# EAGLE design opendeck_mini (EAGLE 7.4.0)
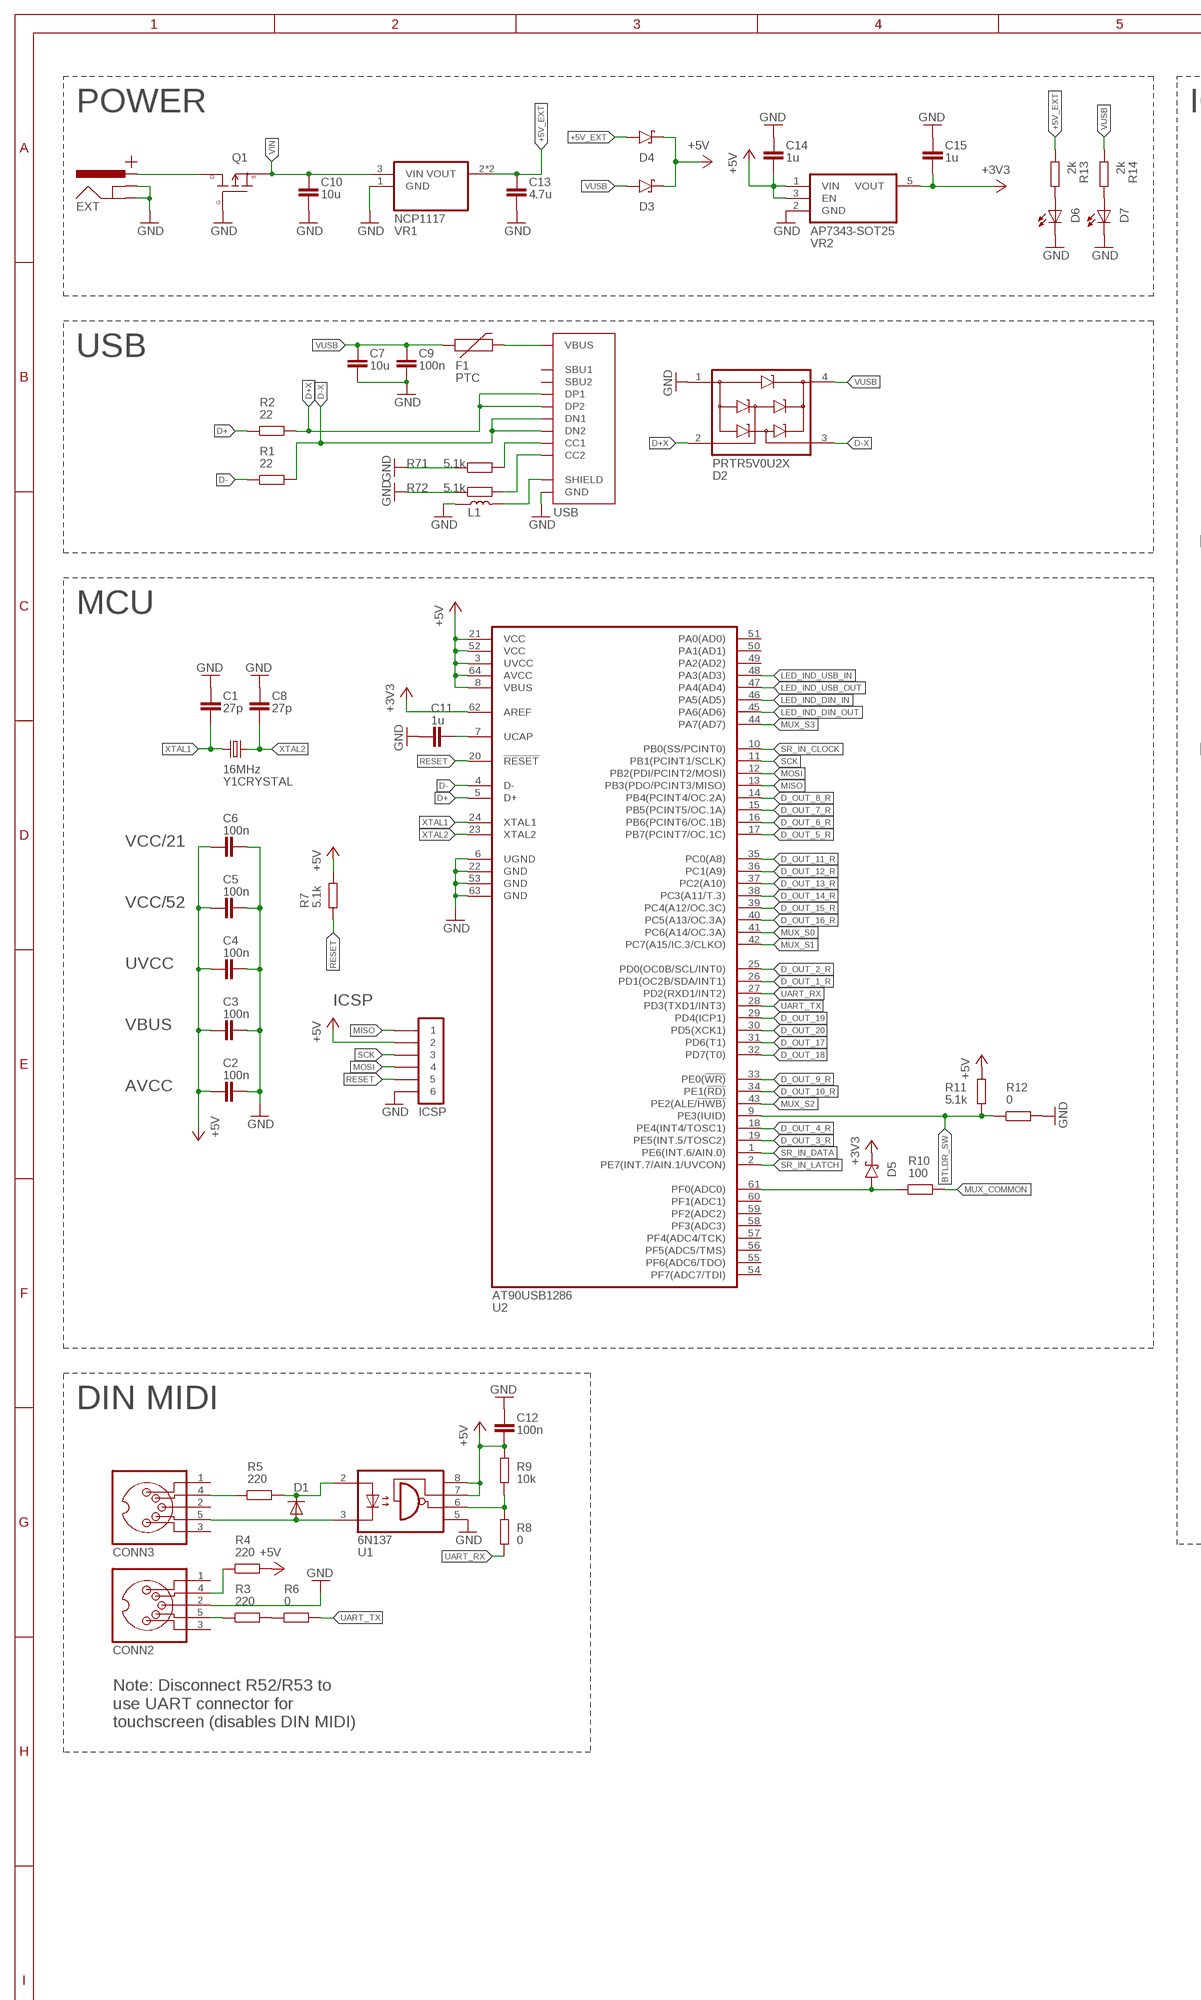
[diagram p0: schematic, sheet 1, part 1 of 2]
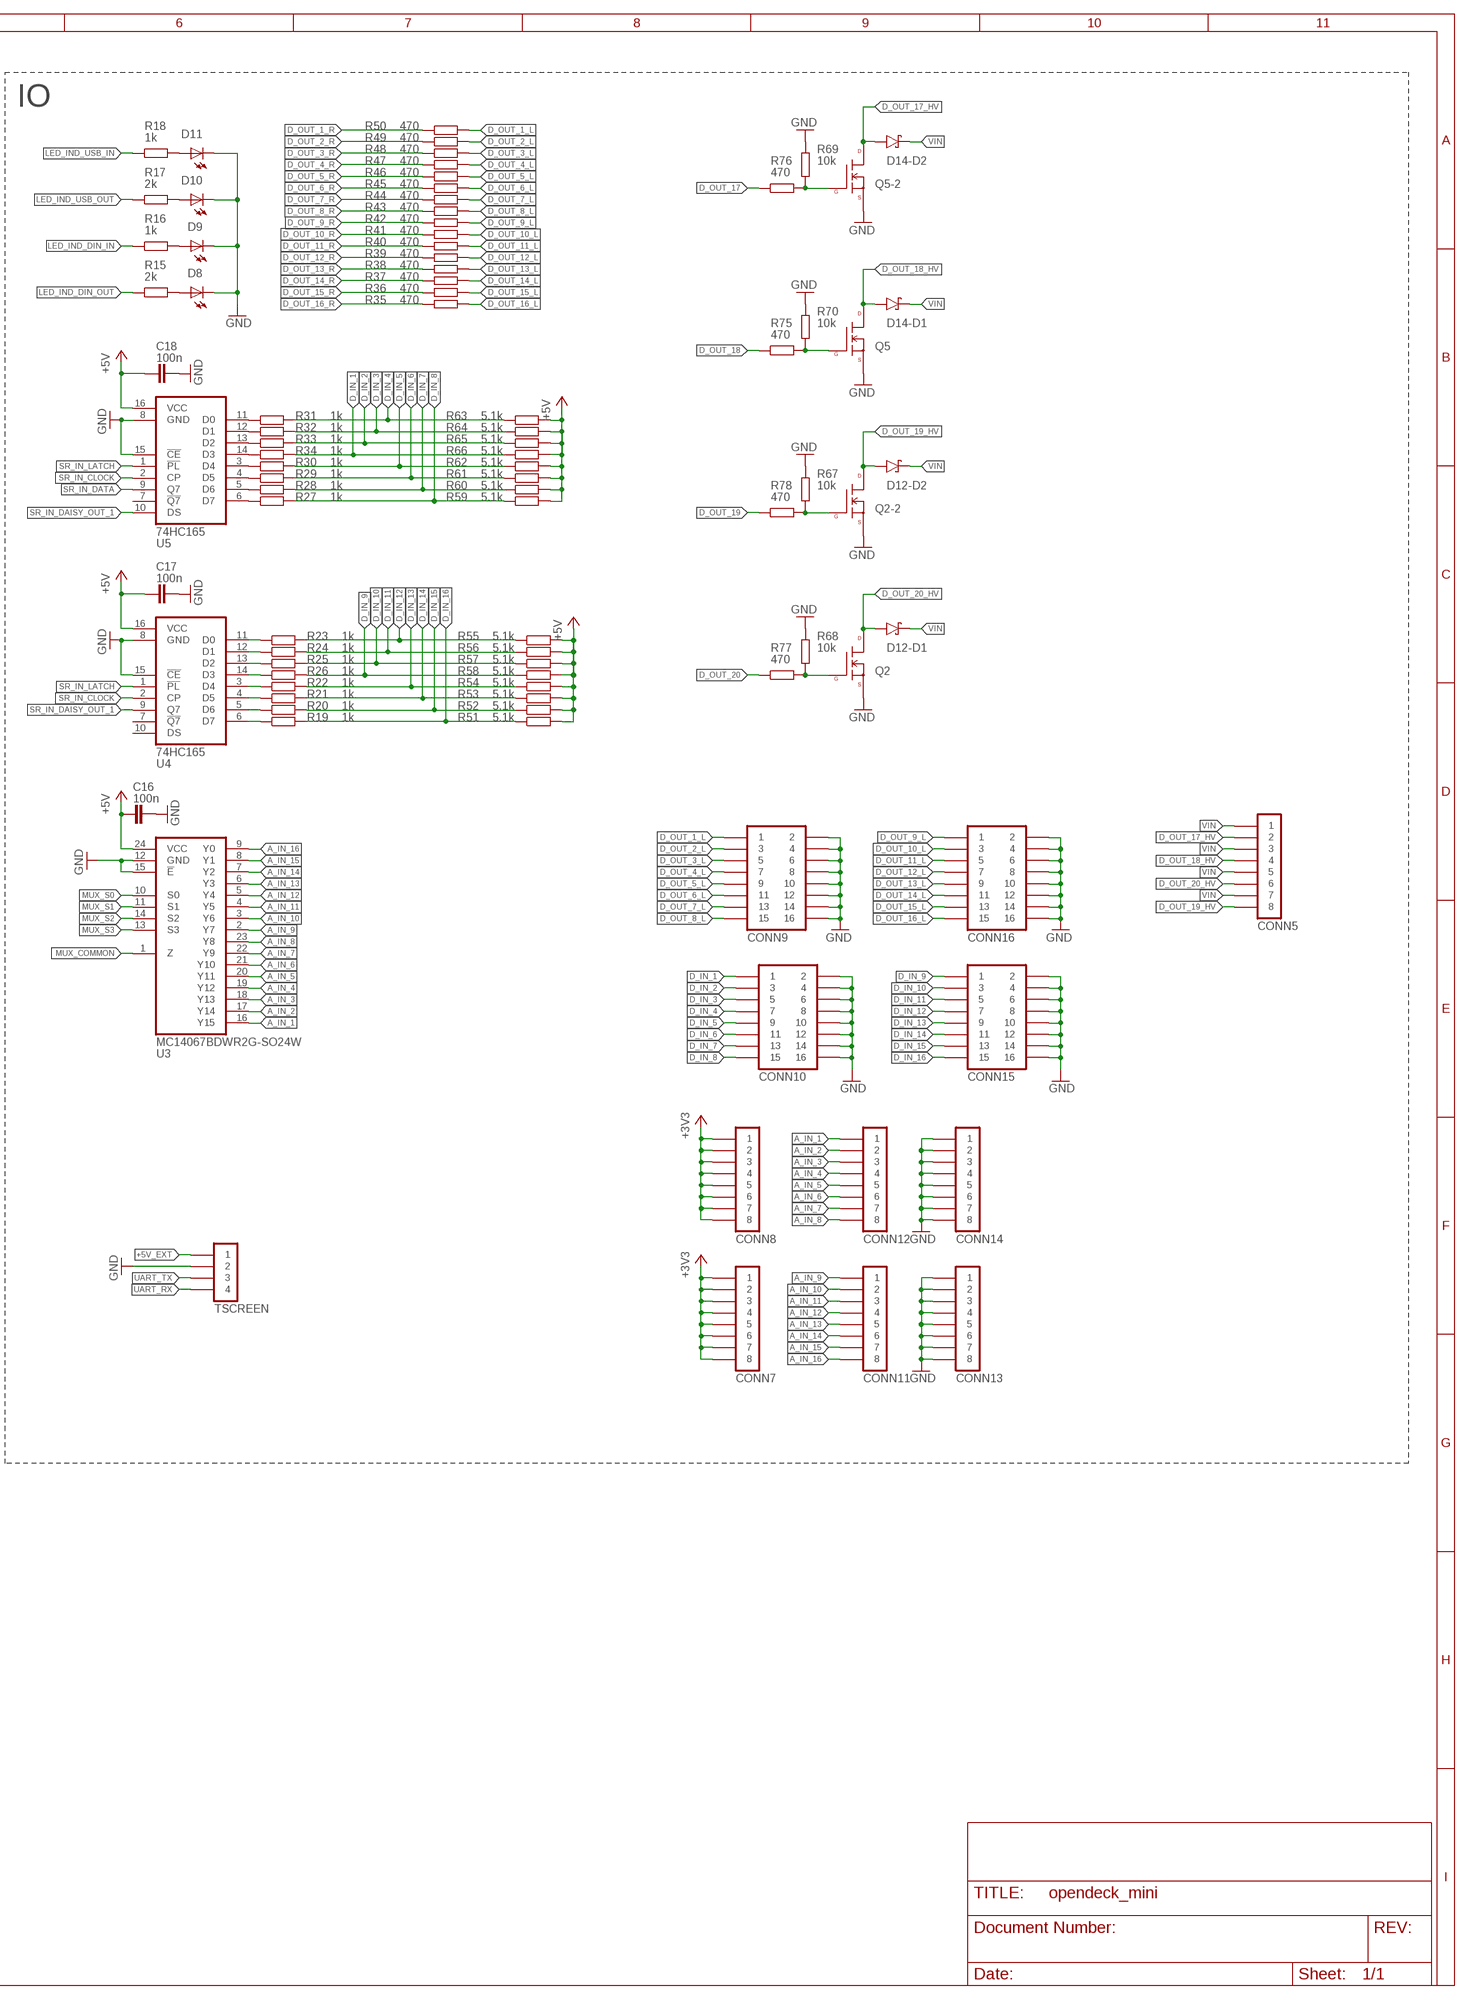
[diagram p1: schematic, sheet 1, part 2 of 2]

## Parts
C1  27p  CAPACITOR-0402  [C0402]
C2  100n  CAPACITOR-0402  [C0402]
C3  100n  CAPACITOR-0402  [C0402]
C4  100n  CAPACITOR-0402  [C0402]
C5  100n  CAPACITOR-0402  [C0402]
C6  100n  CAPACITOR-0402  [C0402]
C7  10u  CAPACITOR-0805  [C0805]
C8  27p  CAPACITOR-0402  [C0402]
C9  100n  CAPACITOR-0402  [C0402]
C10  10u  CAPACITOR-0805  [C0805]
C11  1u  CAPACITOR-0603  [C0603]
C12  100n  CAPACITOR-0402  [C0402]
C13  4.7u  CAPACITOR-0603  [C0603]
C14  1u  CAPACITOR-0603  [C0603]
C15  1u  CAPACITOR-0603  [C0603]
C16  100n  CAPACITOR-0402  [C0402]
C17  100n  CAPACITOR-0402  [C0402]
C18  100n  CAPACITOR-0402  [C0402]
CONN2  MIDI_CONN-STD  [DIN5]
CONN3  MIDI_CONN-STD  [DIN5]
CONN5  PINHD-1X08  [PHOENIX_CONTACT-1984675]
CONN7  PINHD-1X08-TH-2.54MM  [1X08-2.54]
CONN8  PINHD-1X08-TH-2.54MM  [1X08-2.54]
CONN9  PINHD-2X08-TH-2.54MM  [2X08-2.54]
CONN10  PINHD-2X08-TH-2.54MM  [2X08-2.54]
CONN11  PINHD-1X08-TH-2.54MM  [1X08-2.54]
CONN12  PINHD-1X08-TH-2.54MM  [1X08-2.54]
CONN13  PINHD-1X08-TH-2.54MM  [1X08-2.54]
CONN14  PINHD-1X08-TH-2.54MM  [1X08-2.54]
CONN15  PINHD-2X08-TH-2.54MM  [2X08-2.54]
CONN16  PINHD-2X08-TH-2.54MM  [2X08-2.54]
D1  1N4148  DIODE-SOD323  [SOD-323]
D2  PRTR5V0U2X  [SOT143]
D3  BAT46INFEON-SOD123  [SOD-123]
D4  BAT46INFEON-SOD123  [SOD-123]
D5  BAT46-SOT23  [SOT23]
D6  Green  LED-0805  [0805_LED]
D7  Blue  LED-0805  [0805_LED]
D8  Red  LED-0805  [0805_LED]
D9  Yellow  LED-0805  [0805_LED]
D10  Red  LED-0805  [0805_LED]
D11  Yellow  LED-0805  [0805_LED]
D12  BAS7007E6327HTSA1  [SOT143]
D14  BAS7007E6327HTSA1  [SOT143]
EXT  BARREL_JACK  [BARREL_JACK]
F1  PTC  [L1812]
ICSP  PINHD-2X03-TH-2.54MM-V  [2X03-2.54-V]
L1  FERRITE_BEAD-BLM21PG221SN1D  [L0805]
Q1  BSS314PEH6327XTSA1  [SOT23]
Q2  NTGD3148N  [TSOP-6]
Q5  NTGD3148N  [TSOP-6]
R1  22  RESISTOR-0402  [R0402]
R2  22  RESISTOR-0402  [R0402]
R3  220  RESISTOR-0402  [R0402]
R4  220  RESISTOR-0402  [R0402]
R5  220  RESISTOR-0402  [R0402]
R6  0  RESISTOR-TH-2.54  [1X02-2.54-V]
R7  5.1k  RESISTOR-0402  [R0402]
R8  0  RESISTOR-TH-2.54  [1X02-2.54-V]
R9  10k  RESISTOR-0402  [R0402]
R10  100  RESISTOR-0402  [R0402]
R11  5.1k  RESISTOR-0402  [R0402]
R12  0  RESISTOR-TH-2.54  [1X02-2.54-V]
R13  2k  RESISTOR-0402  [R0402]
R14  2k  RESISTOR-0402  [R0402]
R15  2k  RESISTOR-0402  [R0402]
R16  1k  RESISTOR-0402  [R0402]
R17  2k  RESISTOR-0402  [R0402]
R18  1k  RESISTOR-0402  [R0402]
R19  1k  RESISTOR-0402  [R0402]
R20  1k  RESISTOR-0402  [R0402]
R21  1k  RESISTOR-0402  [R0402]
R22  1k  RESISTOR-0402  [R0402]
R23  1k  RESISTOR-0402  [R0402]
R24  1k  RESISTOR-0402  [R0402]
R25  1k  RESISTOR-0402  [R0402]
R26  1k  RESISTOR-0402  [R0402]
R27  1k  RESISTOR-0402  [R0402]
R28  1k  RESISTOR-0402  [R0402]
R29  1k  RESISTOR-0402  [R0402]
R30  1k  RESISTOR-0402  [R0402]
R31  1k  RESISTOR-0402  [R0402]
R32  1k  RESISTOR-0402  [R0402]
R33  1k  RESISTOR-0402  [R0402]
R34  1k  RESISTOR-0402  [R0402]
R35  470  RESISTOR-0402  [R0402]
R36  470  RESISTOR-0402  [R0402]
R37  470  RESISTOR-0402  [R0402]
R38  470  RESISTOR-0402  [R0402]
R39  470  RESISTOR-0402  [R0402]
R40  470  RESISTOR-0402  [R0402]
R41  470  RESISTOR-0402  [R0402]
R42  470  RESISTOR-0402  [R0402]
R43  470  RESISTOR-0402  [R0402]
R44  470  RESISTOR-0402  [R0402]
R45  470  RESISTOR-0402  [R0402]
R46  470  RESISTOR-0402  [R0402]
R47  470  RESISTOR-0402  [R0402]
R48  470  RESISTOR-0402  [R0402]
R49  470  RESISTOR-0402  [R0402]
R50  470  RESISTOR-0402  [R0402]
R51  5.1k  RESISTOR-0402  [R0402]
R52  5.1k  RESISTOR-0402  [R0402]
R53  5.1k  RESISTOR-0402  [R0402]
R54  5.1k  RESISTOR-0402  [R0402]
R55  5.1k  RESISTOR-0402  [R0402]
R56  5.1k  RESISTOR-0402  [R0402]
R57  5.1k  RESISTOR-0402  [R0402]
R58  5.1k  RESISTOR-0402  [R0402]
R59  5.1k  RESISTOR-0402  [R0402]
R60  5.1k  RESISTOR-0402  [R0402]
R61  5.1k  RESISTOR-0402  [R0402]
R62  5.1k  RESISTOR-0402  [R0402]
R63  5.1k  RESISTOR-0402  [R0402]
R64  5.1k  RESISTOR-0402  [R0402]
R65  5.1k  RESISTOR-0402  [R0402]
R66  5.1k  RESISTOR-0402  [R0402]
R67  10k  RESISTOR-0402  [R0402]
R68  10k  RESISTOR-0402  [R0402]
R69  10k  RESISTOR-0402  [R0402]
R70  10k  RESISTOR-0402  [R0402]
R71  5.1k  RESISTOR-0402  [R0402]
R72  5.1k  RESISTOR-0402  [R0402]
R75  470  RESISTOR-0402  [R0402]
R76  470  RESISTOR-0402  [R0402]
R77  470  RESISTOR-0402  [R0402]
R78  470  RESISTOR-0402  [R0402]
TSCREEN  PINHD-1X04-TH-2.54MM  [1X04-2.54]
U1  6N137  [DIL08]
U2  AT90USB1286  [TQFP-64-14X14]
U3  MC14067BDWR2G-SO24W  [SO24-W]
U4  74HC165  [SO16]
U5  74HC165  [SO16]
USB  USB-C  [GCT-USB4085-GF-A]
VR1  NCP1117  [SOT223]
VR2  AP7343-SOT25  [SOT25]
Y1  16MHz  CRYSTAL-4P-SMD-3.2X2.5  [CRYSTAL-SMD-3.2X2.5]

## Nets
+3V3: C15.2 CONN7.1 CONN7.2 CONN7.3 CONN7.4 CONN7.5 CONN7.6 CONN7.7 CONN7.8 CONN8.1 CONN8.2 CONN8.3 CONN8.4 CONN8.5 CONN8.6 CONN8.7 CONN8.8 D5.3(C) U2.62(AREF) VR2.5(VOUT)
+5V: C2.1 C3.1 C4.1 C5.1 C6.1 C12.2 C14.2 C16.1 C17.1 C18.1 D3.C D4.C ICSP.2 R4.2 R7.2 R9.2 R11.2 R51.2 R52.2 R53.2 R54.2 R55.2 R56.2 R57.2 R58.2 R59.2 R60.2 R61.2 R62.2 R63.2 R64.2 R65.2 R66.2 U1.7(VE) U1.8(VCC) U2.3(UVCC) U2.8(VBUS) U2.21(VCC) U2.52(VCC) U2.64(AVCC) U3.24(VCC) U4.16(VCC) U5.16(VCC) VR2.1(VIN) VR2.3(EN)
+5V_EXT: C13.1 D4.A R13.1 TSCREEN.1 VR1.2(VOUT) VR1.4(VOUT)
A_IN_1: CONN12.1 U3.16(Y15)
A_IN_2: CONN12.2 U3.17(Y14)
A_IN_3: CONN12.3 U3.18(Y13)
A_IN_4: CONN12.4 U3.19(Y12)
A_IN_5: CONN12.5 U3.20(Y11)
A_IN_6: CONN12.6 U3.21(Y10)
A_IN_7: CONN12.7 U3.22(Y9)
A_IN_8: CONN12.8 U3.23(Y8)
A_IN_9: CONN11.1 U3.2(Y7)
A_IN_10: CONN11.2 U3.3(Y6)
A_IN_11: CONN11.3 U3.4(Y5)
A_IN_12: CONN11.4 U3.5(Y4)
A_IN_13: CONN11.5 U3.6(Y3)
A_IN_14: CONN11.6 U3.7(Y2)
A_IN_15: CONN11.7 U3.8(Y1)
A_IN_16: CONN11.8 U3.9(Y0)
BTLDR_SW: R11.1 R12.1 U2.9(PE3(IUID))
D+: R2.1 U2.5(D+)
D+X: D2.2(I/O1) R2.2 USB.A6(DP1) USB.B6(DP2)
D-: R1.1 U2.4(D-)
D-X: D2.3(I/O2) R1.2 USB.A7(DN1) USB.B7(DN2)
D_IN_1: CONN10.1 R34.2 R66.1
D_IN_2: CONN10.3 R33.2 R65.1
D_IN_3: CONN10.5 R32.2 R64.1
D_IN_4: CONN10.7 R31.2 R63.1
D_IN_5: CONN10.9 R30.2 R62.1
D_IN_6: CONN10.11 R29.2 R61.1
D_IN_7: CONN10.13 R28.2 R60.1
D_IN_8: CONN10.15 R27.2 R59.1
D_IN_9: CONN15.1 R26.2 R58.1
D_IN_10: CONN15.3 R25.2 R57.1
D_IN_11: CONN15.5 R24.2 R56.1
D_IN_12: CONN15.7 R23.2 R55.1
D_IN_13: CONN15.9 R22.2 R54.1
D_IN_14: CONN15.11 R21.2 R53.1
D_IN_15: CONN15.13 R20.2 R52.1
D_IN_16: CONN15.15 R19.2 R51.1
D_OUT_1_L: CONN9.1 R50.2
D_OUT_1_R: R50.1 U2.26(PD1(OC2B/SDA/INT1))
D_OUT_2_L: CONN9.3 R49.2
D_OUT_2_R: R49.1 U2.25(PD0(OC0B/SCL/INT0))
D_OUT_3_L: CONN9.5 R48.2
D_OUT_3_R: R48.1 U2.19(PE5(INT.5/TOSC2))
D_OUT_4_L: CONN9.7 R47.2
D_OUT_4_R: R47.1 U2.18(PE4(INT4/TOSC1))
D_OUT_5_L: CONN9.9 R46.2
D_OUT_5_R: R46.1 U2.17(PB7(PCINT7/OC.1C))
D_OUT_6_L: CONN9.11 R45.2
D_OUT_6_R: R45.1 U2.16(PB6(PCINT6/OC.1B))
D_OUT_7_L: CONN9.13 R44.2
D_OUT_7_R: R44.1 U2.15(PB5(PCINT5/OC.1A))
D_OUT_8_L: CONN9.15 R43.2
D_OUT_8_R: R43.1 U2.14(PB4(PCINT4/OC.2A))
D_OUT_9_L: CONN16.1 R42.1
D_OUT_9_R: R42.2 U2.33(PE0(!WR))
D_OUT_10_L: CONN16.3 R41.1
D_OUT_10_R: R41.2 U2.34(PE1(!RD))
D_OUT_11_L: CONN16.5 R40.1
D_OUT_11_R: R40.2 U2.35(PC0(A8))
D_OUT_12_L: CONN16.7 R39.1
D_OUT_12_R: R39.2 U2.36(PC1(A9))
D_OUT_13_L: CONN16.9 R38.1
D_OUT_13_R: R38.2 U2.37(PC2(A10))
D_OUT_14_L: CONN16.11 R37.1
D_OUT_14_R: R37.2 U2.38(PC3(A11/T.3))
D_OUT_15_L: CONN16.13 R36.1
D_OUT_15_R: R36.2 U2.39(PC4(A12/OC.3C))
D_OUT_16_L: CONN16.15 R35.1
D_OUT_16_R: R35.2 U2.40(PC5(A13/OC.3A))
D_OUT_17: R76.1 U2.31(PD6(T1))
D_OUT_17_HV: CONN5.2 D14.3(-D2:A) Q5.4(D)
D_OUT_18: R75.1 U2.32(PD7(T0))
D_OUT_18_HV: CONN5.4 D14.4(-D1:A) Q5.6(D)
D_OUT_19: R78.1 U2.29(PD4(ICP1))
D_OUT_19_HV: CONN5.8 D12.3(-D2:A) Q2.4(D)
D_OUT_20: R77.1 U2.30(PD5(XCK1))
D_OUT_20_HV: CONN5.6 D12.4(-D1:A) Q2.6(D)
GND: C1.1 C2.2 C3.2 C4.2 C5.2 C6.2 C7.2 C8.1 C9.2 C10.2 C11.1 C12.1 C13.2 C14.1 C15.1 C16.2 C17.2 C18.2 CONN2.2 CONN9.2 CONN9.4 CONN9.6 CONN9.8 CONN9.10 CONN9.12 CONN9.14 CONN9.16 CONN10.2 CONN10.4 CONN10.6 CONN10.8 CONN10.10 CONN10.12 CONN10.14 CONN10.16 CONN13.1 CONN13.2 CONN13.3 CONN13.4 CONN13.5 CONN13.6 CONN13.7 CONN13.8 CONN14.1 CONN14.2 CONN14.3 CONN14.4 CONN14.5 CONN14.6 CONN14.7 CONN14.8 CONN15.2 CONN15.4 CONN15.6 CONN15.8 CONN15.10 CONN15.12 CONN15.14 CONN15.16 CONN16.2 CONN16.4 CONN16.6 CONN16.8 CONN16.10 CONN16.12 CONN16.14 CONN16.16 D2.1(GND) D6.C D7.C D8.C D9.C D10.C D11.C EXT.GND@1(GND) EXT.GND@2(GNDBREAK) ICSP.6 L1.1 Q1.1(G) Q2.2(S) Q2.5(S) Q5.2(S) Q5.5(S) R12.2 R67.2 R68.2 R69.2 R70.2 R71.1 R72.1 TSCREEN.2 U1.5(GND) U2.6(UGND) U2.22(GND) U2.53(GND) U2.63(GND) U3.12(GND) U3.15(!E) U4.8(GND) U4.15(!CE) U5.8(GND) U5.15(!CE) USB.A1(GND) USB.A12(GND) USB.B1(GND) USB.B12(GND) VR1.1(GND) VR2.2(GND)
LED_IND_DIN_IN: R16.1 U2.46(PA5(AD5))
LED_IND_DIN_OUT: R15.1 U2.45(PA6(AD6))
LED_IND_USB_IN: R18.1 U2.48(PA3(AD3))
LED_IND_USB_OUT: R17.1 U2.47(PA4(AD4))
MISO: ICSP.1 U2.13(PB3(PDO/PCINT3/MISO))
MOSI: ICSP.4 U2.12(PB2(PDI/PCINT2/MOSI))
MUX_COMMON: R10.2 U3.1(Z)
MUX_S0: U2.41(PC6(A14/OC.3A)) U3.10(S0)
MUX_S1: U2.42(PC7(A15/IC.3/CLKO)) U3.11(S1)
MUX_S2: U2.43(PE2(ALE/!HWB)) U3.14(S2)
MUX_S3: U2.44(PA7(AD7)) U3.13(S3)
N$1: CONN3.4 R5.1
N$2: F1.2 USB.A4(VBUS) USB.A9(VBUS) USB.B4(VBUS) USB.B9(VBUS)
N$3: D1.C R5.2 U1.2(A)
N$4: CONN3.5 D1.A U1.3(C)
N$5: CONN2.4 R4.1
N$6: CONN2.5 R3.1
N$7: R3.2 R6.1
N$8: R34.1 U5.14(D3)
N$9: R33.1 U5.13(D2)
N$10: R32.1 U5.12(D1)
N$11: D11.A R18.2
N$12: D10.A R17.2
N$13: D9.A R16.2
N$14: D8.A R15.2
N$15: R31.1 U5.11(D0)
N$16: R30.1 U5.3(D4)
N$17: R29.1 U5.4(D5)
N$18: R28.1 U5.5(D6)
N$19: R27.1 U5.6(D7)
N$20: D5.1(A) R10.1 U2.61(PF0(ADC0))
N$21: D6.A R13.2
N$22: D7.A R14.2
N$23: R8.2 R9.1 U1.6(VO)
N$24: Q5.1(G) R70.1 R75.2
N$25: Q5.3(G) R69.1 R76.2
N$26: Q2.1(G) R68.1 R77.2
N$27: EXT.PWR1(PWR) Q1.2(S)
N$28: R71.2 USB.A5(CC1)
N$29: Q2.3(G) R67.1 R78.2
N$30: L1.2 USB.P1(SHIELD) USB.P2(SHIELD) USB.P3(SHIELD) USB.P4(SHIELD)
N$31: R72.2 USB.B5(CC2)
N$40: R26.1 U4.14(D3)
N$41: R25.1 U4.13(D2)
N$42: R24.1 U4.12(D1)
N$43: R23.1 U4.11(D0)
N$44: R22.1 U4.3(D4)
N$45: R21.1 U4.4(D5)
N$46: R20.1 U4.5(D6)
N$47: R19.1 U4.6(D7)
RESET: ICSP.5 R7.1 U2.20(!RESET)
SCK: ICSP.3 U2.11(PB1(PCINT1/SCLK))
SR_IN_CLOCK: U2.10(PB0(SS/PCINT0)) U4.2(CP) U5.2(CP)
SR_IN_DAISY_OUT_1: U4.9(Q7) U5.10(DS)
SR_IN_DATA: U2.1(PE6(INT.6/AIN.0)) U5.9(Q7)
SR_IN_LATCH: U2.2(PE7(INT.7/AIN.1/UVCON)) U4.1(!PL) U5.1(!PL)
UART_RX: R8.1 TSCREEN.4 U2.27(PD2(RXD1/INT2))
UART_TX: R6.2 TSCREEN.3 U2.28(PD3(TXD1/INT3))
UCAP: C11.2 U2.7(UCAP)
VIN: C10.1 CONN5.1 CONN5.3 CONN5.5 CONN5.7 D12.1(-D1:C) D12.2(-D2:C) D14.1(-D1:C) D14.2(-D2:C) Q1.3(D) VR1.3(VIN)
VUSB: C7.1 C9.1 D2.4(VCC) D3.A F1.1 R14.1
XTAL1: C1.2 U2.24(XTAL1) Y1.1
XTAL2: C8.2 U2.23(XTAL2) Y1.3
Unconnected: CONN2.1 CONN2.3 CONN3.1 CONN3.2 CONN3.3 U2.49(PA2(AD2)) U2.50(PA1(AD1)) U2.51(PA0(AD0)) U2.54(PF7(ADC7/TDI)) U2.55(PF6(ADC6/TDO)) U2.56(PF5(ADC5/TMS)) U2.57(PF4(ADC4/TCK)) U2.58(PF3(ADC3)) U2.59(PF2(ADC2)) U2.60(PF1(ADC1)) U4.7(!Q7) U4.10(DS) U5.7(!Q7) USB.A8(SBU1) USB.B8(SBU2) Y1.2(GND1:VEE) Y1.4(GND2:VEE)

## Notes on the sheet
- POWER | IO
- USB
- MCU
- VCC/21
- VCC/52
- UVCC
- ICSP
- VBUS
- AVCC
- DIN MIDI
- Note: Disconnect R52/R53 to
  use UART connector for
  touchscreen (disables DIN MIDI)

## Library data of the parts
C1-C18 = igor_lbr:CAPACITOR: Capacitor
CONN2 CONN3 = igor_lbr:MIDI_CONN: DIN MIDI connector; MANUFACTURER: Switchcraft; MPN: 57PC5F
CONN5 = igor_lbr:PINHD-1X08; MANUFACTURER: Phoenix Contact; MPN: 1984675
CONN7 CONN8 CONN11-CONN14 = igor_lbr:PINHD-1X08
CONN9 CONN10 CONN15 CONN16 = igor_lbr:PINHD-2X08
D1 = igor_lbr:DIODE: Diode; MANUFACTURER: Comchip Technology; MPN: 1N4148WS-HF
D2 = igor_lbr:PRTR5V0U2X: Ultra low capacitance double rail-to-rail ESD protection diode; MANUFACTURER: Nexperia; MPN: PRTR5V0U2X
D3 D4 = igor_lbr:BAT46: Schottky Diode; MANUFACTURER: Infineon Technologies; MPN: BAT60AE6327HTSA1
D5 = igor_lbr:BAT46: Schottky Diode; MANUFACTURER: Micro Commercial Components (MCC); MPN: MMBD301-TP
D6-D11 = igor_lbr:LED: LED
D12 D14 = igor_lbr:BAS7007E6327HTSA1: Dual Schottky Diode; MANUFACTUER: Infineon; MPN: BAS7007E6327HTSA1
EXT = igor_lbr:BARREL_JACK: 5.5mm jack, with a 2.1mm center pole diameter; MANUFACTURER: Gravitech; MPN: CON-SOCJ-2155
F1 = igor_lbr:PTC: Fuse; MANUFACTURER: Bourns; MPN: MF-MSMF050-2
ICSP = igor_lbr:PINHD-2X03
L1 = igor_lbr:FERRITE_BEAD: Ferrite Bead; MANUFACTURER: Murata; MPN: BLM21PG221SN1D
Q1 = igor_lbr:BSS314PEH6327XTSA1: P-Channel 20 V (D-S) MOSFET; MANUFACTURER: Infineon Technologies; MPN: BSS314PEH6327XTSA1
Q2 Q5 = igor_lbr:NTGD3148N: Dual N-channel MOSFET; MANUFACTURER: ON Semiconductor; MPN: NTGD3148NT1G
R1-R72 R75-R78 = igor_lbr:RESISTOR: Resistor
TSCREEN = igor_lbr:PINHD-1X04
U1 = igor_lbr:6N137: High Speed Optocoupler; MANUFACTURER: Vishay; MPN: 6N137
U2 = igor_lbr:AT90USB1286: 8-bit microcontroller; MANUFACTURER: Microchip/Atmel; MPN: AT90USB1286-AU
U3 = igor_lbr:MC14067BDWR2G: 16-Channel Analog Multiplexer/Demultiplexer; MANUFACTURER: ON Semiconductor; MPN: MC14067BDWR2G
U4 U5 = igor_lbr:74*165: 8-bit parallel-in/serial out shift register; MANUFACTURER: Nexperia; MPN: 74HC165D
USB = igor_lbr:USB-C: USB-C 2.0; MANUFACTURER: GCT; MPN: USB4085-GF-A
VR1 = igor_lbr:NCP1117: Low-Dropout Positive Fixed and Adjustable Voltage Regulators; MANUFACTURER: ON Semiconductor; MPN: NCP1117ST50T3G
VR2 = igor_lbr:AP7343: 300mA 3.3V HIGH PSRR LOW NOISE LDO WITH ENABLE; MANUFACTURER: Diodes Incorporated; MPN: AP7343-33W5-7
Y1 = igor_lbr:CRYSTAL-4P: Crystal; MANUFACTURER: Epson; MPN: X1E0000210120 TSX-3225 16MHZ 16PF

## Board
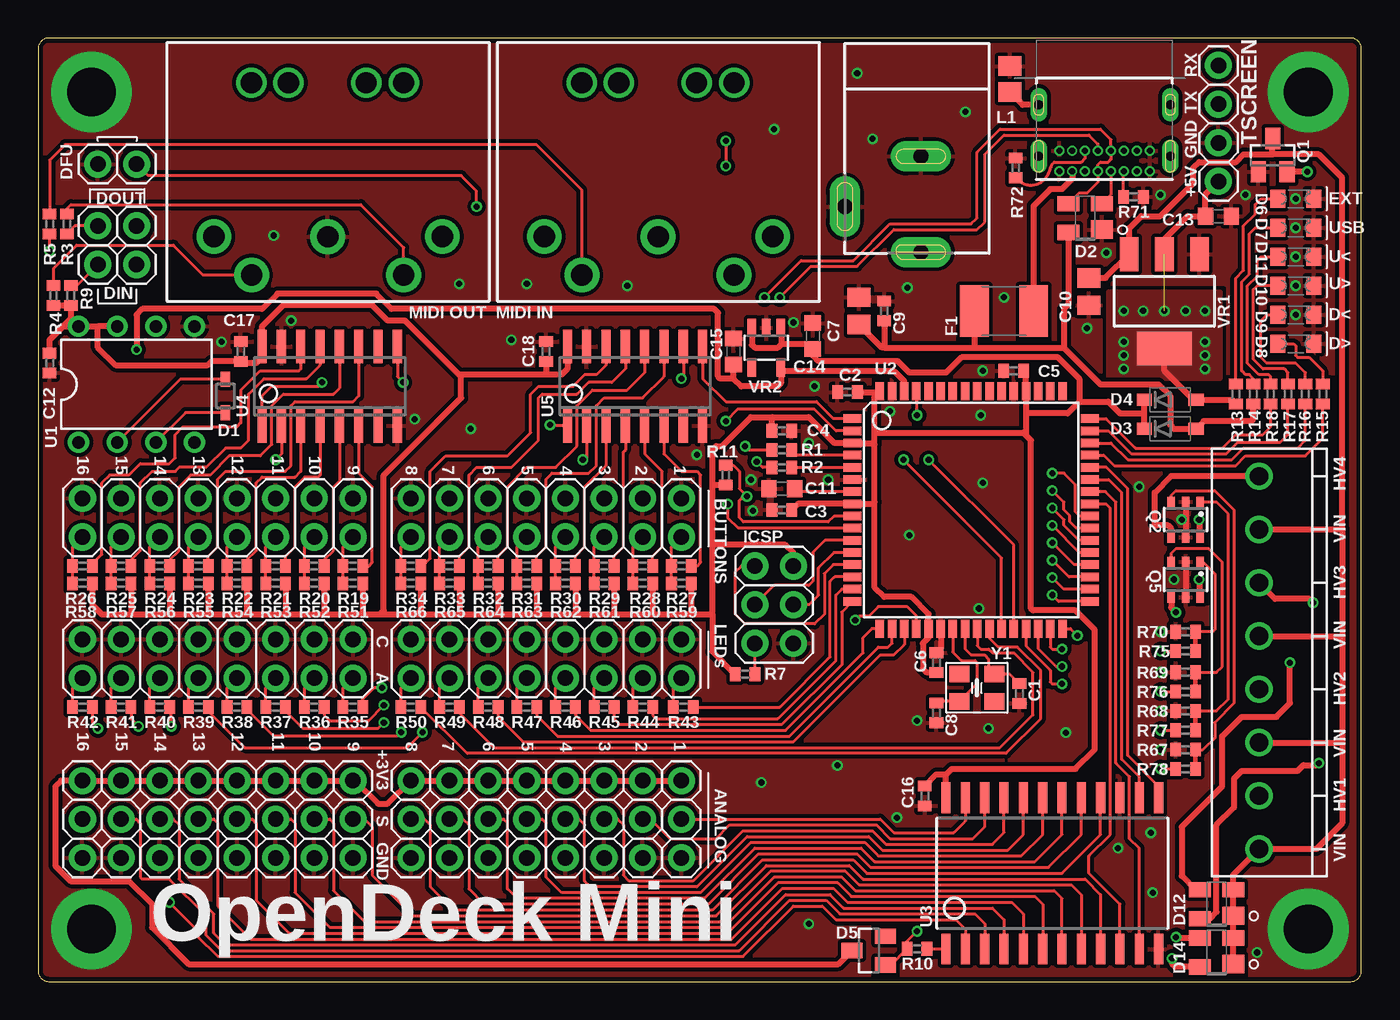
[diagram p2: board, top side]
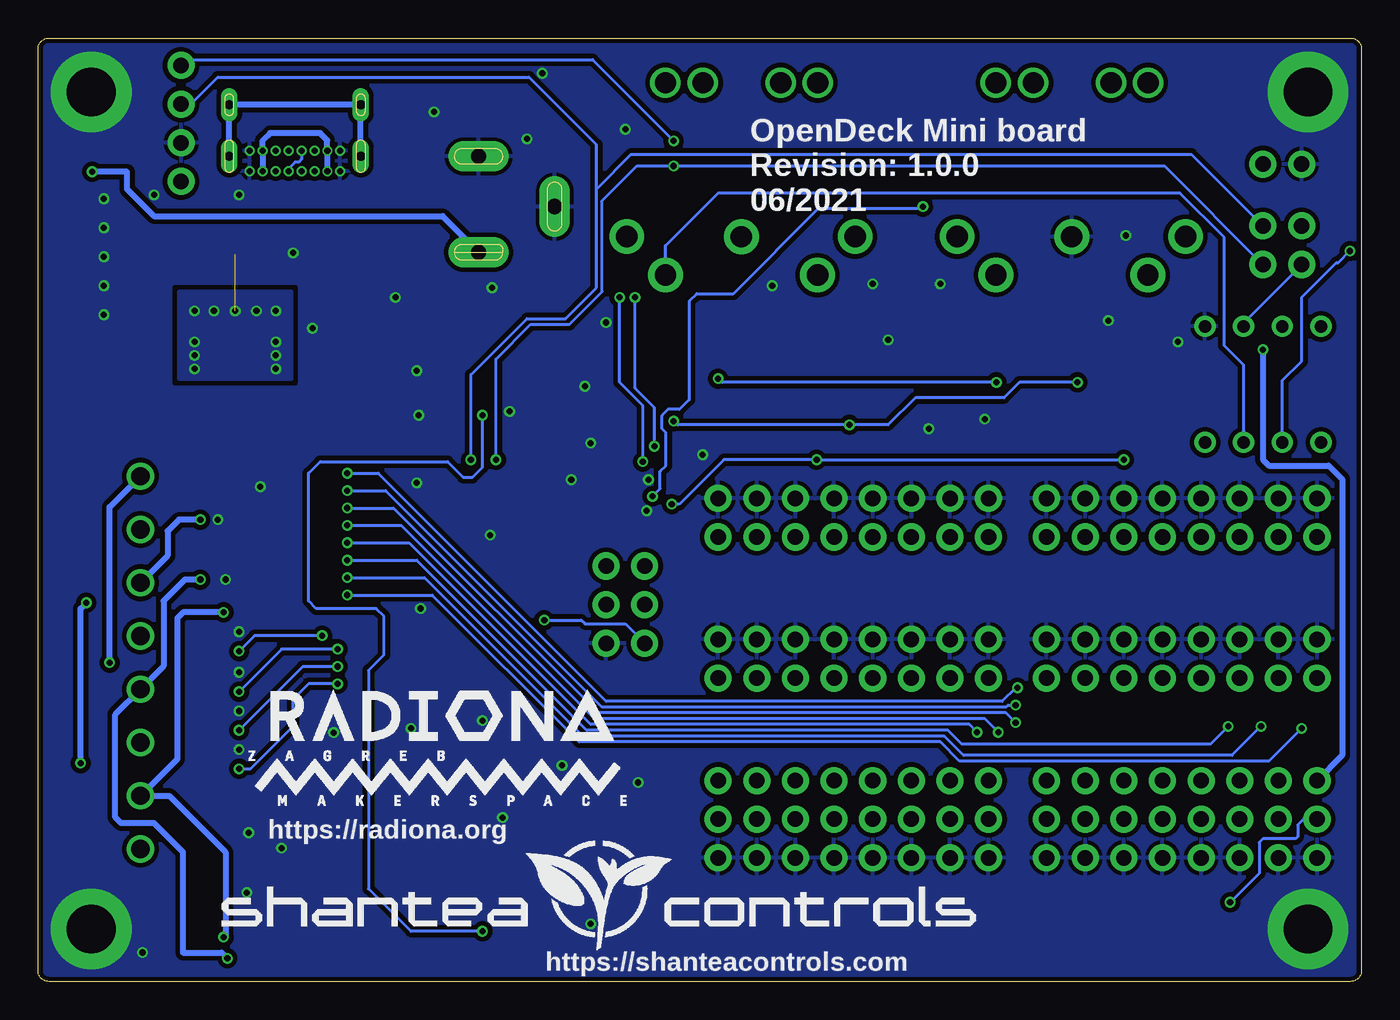
[diagram p3: board, bottom side, seen from below]

Size 87 x 62 mm. Coordinates in mm from the lower left corner, seen from the top.
Outline: 87,0.71 87,61.29 arc90 86.29,62 0.71,62 arc90 0,61.29 0,0.71 arc90 0.71,0 86.29,0 arc90 87,0.71
Copper layers (1*16): Top 0.035mm / dielectric 1.5mm / Bottom 0.035mm
Design rules "smiery *": minimum track width 8mil, minimum drill 12mil, track to track 7mil, track to pad 6mil, pad to pad 5mil, via to via 6mil, smd to smd 0mil, copper to edge 12mil, drill to drill 10mil, minimum pad ring 5mil, minimum via ring 5mil, stop-mask expansion 2mil, vias tented up to drill 25mil, thermal gap 10mil

### Footprints (pad centres in the part's own frame; a part is rotated, then mirrored left to right if it is on the bottom)
C0402 = smd 0.7 x 0.9: 1 -0.65,0; 2 0.65,0
C0805 = smd 1.27 x 1.524: 1 -0.9,0; 2 0.9,0
C0603 = smd 1 x 1.1: 1 -0.85,0; 2 0.85,0
DIN5 = drill 1.4 pad 2.286: 1 -7.483,-4.768; 2 -0.003,-4.778; 3 7.527,-4.768; 4 -5.013,-7.298; 5 4.987,-7.288 | drill 1.4 pad 2: 6 4.987,5.341; 7 -5.02,5.341; 8 -2.582,5.341; 9 2.523,5.341
PHOENIX_CONTACT-1984675 = drill 1.2 pad 1.8: 1 -12.25,0; 2 -8.75,0; 3 -5.25,0; 4 -1.75,0; 5 1.75,0; 6 5.25,0; 7 8.75,0; 8 12.25,0
1X08-2.54 = drill 1.016 pad 1.778: 1 -8.89,0; 2 -6.35,0; 3 -3.81,0; 4 -1.27,0; 5 1.27,0; 6 3.81,0; 7 6.35,0; 8 8.89,0
2X08-2.54 = drill 1.016 pad 1.778: 1 -8.89,-1.27; 2 -8.89,1.27; 3 -6.35,-1.27; 4 -6.35,1.27; 5 -3.81,-1.27; 6 -3.81,1.27; 7 -1.27,-1.27; 8 -1.27,1.27; 9 1.27,-1.27; 10 1.27,1.27; 11 3.81,-1.27; 12 3.81,1.27; 13 6.35,-1.27; 14 6.35,1.27; 15 8.89,-1.27; 16 8.89,1.27
SOD-323 = smd 1 x 0.6: A 1.1,0; C -1.1,0
SOT143 = smd 1.44 x 1.2: 1 -1.1,0.75 | smd 1.44 x 1: 2 -1.1,-0.95; 3 1.1,-0.95; 4 1.1,0.95
SOD-123 = smd 1 x 0.8: A -1.7,0; C 1.7,0
SOT23 = smd 1.4 x 1: 1 -1.1,0.95; 2 -1.1,-0.95; 3 1.1,0
0805_LED = smd 0.978 x 1.2: A -1.175,0; C 1.18,0
BARREL_JACK = drill 1 pad 2 long: GND@1 0,0.13; GND@2 5,3.43; PWR1 0,6.43
L1812 = smd 1.9 x 3.4: 1 -1.95,0; 2 1.95,0
2X03-2.54-V = drill 1.016 pad 1.778: 1 -2.54,-1.27; 2 -2.54,1.27; 3 0,-1.27; 4 0,1.27; 5 2.54,-1.27; 6 2.54,1.27
L0805 = smd 1.3 x 1.5: 1 -0.85,0; 2 0.85,0
TSOP-6 = smd 0.7 x 0.508: 1 -1.163,0.95; 2 -1.163,0; 3 -1.163,-0.95; 4 1.163,-0.95; 5 1.163,0; 6 1.163,0.95
R0402 = smd 0.7 x 0.9: 1 -0.65,0; 2 0.65,0
1X02-2.54-V = drill 1.016 pad 1.778: 1 -1.27,0; 2 1.27,0
1X04-2.54 = drill 1.016 pad 1.778: 1 -3.81,0; 2 -1.27,0; 3 1.27,0; 4 3.81,0
DIL08 = drill 0.813 pad 1.397: 1 -3.81,3.81; 2 -3.81,1.27; 3 -3.81,-1.27; 4 -3.81,-3.81; 5 3.81,-3.81; 6 3.81,-1.27; 7 3.81,1.27; 8 3.81,3.81
TQFP-64-14X14 = smd 1.194 x 0.559: 1 -7.8,6; 2 -7.8,5.2; 3 -7.8,4.4; 4 -7.8,3.6; 5 -7.8,2.8; 6 -7.8,2; 7 -7.8,1.2; 8 -7.8,0.4; 9 -7.8,-0.4; 10 -7.8,-1.2; 11 -7.8,-2; 12 -7.8,-2.8; 13 -7.8,-3.6; 14 -7.8,-4.4; 15 -7.8,-5.2; 16 -7.8,-6; 33 7.8,-6; 34 7.8,-5.2; 35 7.8,-4.4; 36 7.8,-3.6; 37 7.8,-2.8; 38 7.8,-2; 39 7.8,-1.2; 40 7.8,-0.4; 41 7.8,0.4; 42 7.8,1.2; 43 7.8,2; 44 7.8,2.8; 45 7.8,3.6; 46 7.8,4.4; 47 7.8,5.2; 48 7.8,6 | smd 0.559 x 1.194: 17 -6,-7.8; 18 -5.2,-7.8; 19 -4.4,-7.8; 20 -3.6,-7.8; 21 -2.8,-7.8; 22 -2,-7.8; 23 -1.2,-7.8; 24 -0.4,-7.8; 25 0.4,-7.8; 26 1.2,-7.8; 27 2,-7.8; 28 2.8,-7.8; 29 3.6,-7.8; 30 4.4,-7.8; 31 5.2,-7.8; 32 6,-7.8; 49 6,7.8; 50 5.2,7.8; 51 4.4,7.8; 52 3.6,7.8; 53 2.8,7.8; 54 2,7.8; 55 1.2,7.8; 56 0.4,7.8; 57 -0.4,7.8; 58 -1.2,7.8; 59 -2,7.8; 60 -2.8,7.8; 61 -3.6,7.8; 62 -4.4,7.8; 63 -5.2,7.8; 64 -6,7.8
SO24-W = smd 2.032 x 0.6: 1 -4.975,6.985; 2 -4.975,5.715; 3 -4.975,4.445; 4 -4.975,3.175; 5 -4.975,1.905; 6 -4.975,0.635; 7 -4.975,-0.635; 8 -4.975,-1.905; 9 -4.975,-3.175; 10 -4.975,-4.445; 11 -4.975,-5.715; 12 -4.975,-6.985; 13 4.975,-6.985; 14 4.975,-5.715; 15 4.975,-4.445; 16 4.975,-3.175; 17 4.975,-1.905; 18 4.975,-0.635; 19 4.975,0.635; 20 4.975,1.905; 21 4.975,3.175; 22 4.975,4.445; 23 4.975,5.715; 24 4.975,6.985
SO16 = smd 2.2 x 0.6: 1 -2.6,4.445; 2 -2.6,3.175; 3 -2.6,1.905; 4 -2.6,0.635; 5 -2.6,-0.635; 6 -2.6,-1.905; 7 -2.6,-3.175; 8 -2.6,-4.445; 9 2.6,-4.445; 10 2.6,-3.175; 11 2.6,-1.905; 12 2.6,-0.635; 13 2.6,0.635; 14 2.6,1.905; 15 2.6,3.175; 16 2.6,4.445
GCT-USB4085-GF-A = drill 0.4 pad 0.65: A1 -2.975,4.025; A4 -2.125,4.025; A5 -1.275,4.025; A6 -0.425,4.025; A7 0.425,4.025; A8 1.275,4.025; A9 2.125,4.025; A12 2.975,4.025; B1 2.975,2.675; B4 2.125,2.675; B5 1.275,2.675; B6 0.425,2.675; B7 -0.425,2.675; B8 -1.275,2.675; B9 -2.125,2.675; B12 -2.975,2.675 | drill 0.6 pad 1.1 long: P1 -4.325,3.045; P2 4.325,3.045; P3 4.325,-0.335; P4 -4.325,-0.335
SOT223 = smd 2.235 x 1.219: 1 -3.099,2.311; 2 -3.099,0; 3 -3.099,-2.311 | smd 2.2 x 3.6: 4 3.099,0
SOT25 = smd 0.55 x 1.2: 1 -0.95,-1.3; 2 0,-1.3; 3 0.95,-1.3; 4 0.95,1.3; 5 -0.95,1.3
CRYSTAL-SMD-3.2X2.5 = smd 1.3 x 1.1: 1 -1.15,-0.9; 2 1.15,-0.9; 3 1.15,0.9; 4 -1.15,0.9

### Placement (x,y rotation side)
C1  64.52,18.92 90 top
C2  53.21,38.73 180 top
C3  48.9,30.99 180 top
C4  48.9,36.2 0 top
C5  64.14,40.13 180 top
C6  59.05,20.95 90 top
C7  53.98,44.07 90 top
C8  59.05,17.65 90 top
C9  55.63,44.07 90 top
C10  69.09,45.34 270 top
C11  48.9,32.38 0 top
C12  0.76,40.64 90 top
C13  77.6,50.29 0 top
C14  50.93,42.42 270 top
C15  45.72,41.4 270 top
C16  58.29,12.19 270 top
C17  13.34,41.4 90 top
C18  33.4,41.4 90 top
CONN2  19.05,53.72 0 top
CONN3  40.77,53.72 0 top
CONN5  80.26,20.95 90 top
CONN7  11.81,13.21 0 top
CONN8  33.4,13.21 0 top
CONN9  33.4,21.21 0 top
CONN10  33.4,30.48 0 top
CONN11  11.81,10.67 0 top
CONN12  33.4,10.67 0 top
CONN13  11.81,8.13 0 top
CONN14  33.4,8.13 0 top
CONN15  11.81,30.48 0 top
CONN16  11.81,21.21 0 top
D1  12.32,38.48 270 top
D2  68.83,50.16 180 top
D3  74.42,36.32 180 top
D4  74.42,38.23 180 top
D5  54.61,2.03 180 top
D6  82.68,51.44 0 top
D7  82.68,49.53 0 top
D8  82.68,41.91 0 top
D9  82.68,43.81 0 top
D10  82.68,45.72 0 top
D11  82.68,47.62 0 top
D12  77.47,5.08 180 top
D14  77.47,1.91 180 top
EXT  58.04,54.36 180 top
F1  63.5,44.07 0 top
ICSP  48.39,24.77 270 top
L1  63.88,59.31 270 top
Q1  81.16,54.31 90 top
Q2  75.44,30.35 270 top
Q5  75.44,26.42 270 top
R1  48.9,34.92 180 top
R2  48.9,33.78 180 top
R3  1.91,49.78 270 top
R4  1.02,45.09 270 top
R5  0.76,49.78 270 top
R6  5.21,49.66 0 top
R7  46.48,20.19 180 top
R8  5.21,47.12 180 top
R9  2.16,45.09 270 top
R10  57.78,2.16 0 top
R11  45.21,33.27 270 top
R12  5.21,53.72 180 top
R13  78.74,38.61 90 top
R14  79.88,38.61 90 top
R15  84.45,38.61 90 top
R16  83.31,38.61 90 top
R17  82.17,38.61 90 top
R18  81.03,38.61 90 top
R19  20.7,27.3 180 top
R20  18.16,27.3 180 top
R21  15.62,27.3 180 top
R22  13.08,27.3 180 top
R23  10.54,27.3 180 top
R24  8,27.3 180 top
R25  5.46,27.3 180 top
R26  2.92,27.3 180 top
R27  42.29,27.3 180 top
R28  39.75,27.3 180 top
R29  37.21,27.3 180 top
R30  34.67,27.3 180 top
R31  32.13,27.3 180 top
R32  29.59,27.3 180 top
R33  27.05,27.3 180 top
R34  24.51,27.3 180 top
R35  20.7,18.03 0 top
R36  18.16,18.03 0 top
R37  15.62,18.03 0 top
R38  13.08,18.03 0 top
R39  10.54,18.03 0 top
R40  8,18.03 0 top
R41  5.46,18.03 0 top
R42  2.92,18.03 0 top
R43  42.42,18.03 180 top
R44  39.75,18.03 180 top
R45  37.21,18.03 180 top
R46  34.67,18.03 180 top
R47  32.13,18.03 180 top
R48  29.59,18.03 180 top
R49  27.05,18.03 180 top
R50  24.51,18.03 180 top
R51  20.7,26.16 0 top
R52  18.16,26.16 0 top
R53  15.62,26.16 0 top
R54  13.08,26.16 0 top
R55  10.54,26.16 0 top
R56  8,26.16 0 top
R57  5.46,26.16 0 top
R58  2.92,26.16 0 top
R59  42.29,26.16 0 top
R60  39.75,26.16 0 top
R61  37.21,26.16 0 top
R62  34.67,26.16 0 top
R63  32.13,26.16 0 top
R64  29.59,26.16 0 top
R65  27.05,26.16 0 top
R66  24.51,26.16 0 top
R67  75.44,15.24 180 top
R68  75.44,17.78 180 top
R69  75.44,20.32 180 top
R70  75.44,22.99 180 top
R71  72.01,51.56 180 top
R72  64.26,53.47 270 top
R75  75.44,21.72 0 top
R76  75.44,19.05 0 top
R77  75.44,16.51 0 top
R78  75.44,13.97 0 top
TSCREEN  77.6,56.39 90 top
U1  6.48,39.24 90 top
U2  61.34,30.99 0 top
U3  66.67,7.11 90 top
U4  19.18,39.12 90 top
U5  39.24,39.12 90 top
USB  70.1,57.28 180 top
VR1  74.04,44.7 270 top
VR2  47.88,41.66 180 top
Y1  61.72,19.3 180 top

### Tracks (layer width: path | path; a pad name or v marks a point on that pad's centre or on a via)
+3V3  (via drill 0.4 pad 0.7)
  Top 0.406: U2.62 56.94,39.45 56.29,40.1 49.08,40.1 VR2.5 48.83,39.3 48.64,39.12 46.23,39.12 45.72,39.62 | CONN8.8 CONN8.7 CONN8.6 CONN8.5 CONN8.4 CONN8.3 CONN8.2 CONN8.1 22.99,11.68 22.35,11.68 20.83,13.21 CONN7.8 CONN7.7 CONN7.6 CONN7.5 CONN7.4 CONN7.3 CONN7.2 CONN7.1 1.52,13.21 1.14,12.83 1.14,7.62 2.16,6.6 5.97,6.6 7.49,5.08 7.49,3.56 9.91,1.14 52.62,1.14 D5.3 | 45.72,39.62 C15.2 | 45.72,39.62 44.83,39.62 44.7,39.75 44.7,43.94 44.45,44.2 23.24,44.2 22.23,45.21 15.75,45.21 14.73,44.2 6.86,44.2 6.48,43.81 v6.48,41.53
  Bottom 0.406: v6.48,41.53 6.48,34.29 6.1,33.91 2.16,33.91 1.27,33.02 1.27,14.86 CONN7.1
+5V
  Top 0.406: 54.99,31.5 54.88,31.39 U2.8 49.95,31.39 C3.1 | 54.99,31.5 54.99,35.31 | 54.99,35.31 54.99,36.07 | 54.99,31.5 54.99,25.91 55.63,25.27 57.4,25.27 58.54,24.14 U2.21 58.54,22.6 58.17,22.23 58.17,20.57 58.44,20.3 C6.1 | 54.99,35.31 54.91,35.39 U2.3 52.37,35.39 50.67,37.08 48.26,37.08 | D3.C 72.72,37.34 | 72.72,37.34 D4.C | VR2.3 46.93,41.84 47.12,41.66 48.64,41.66 48.9,41.91 | 48.9,41.91 48.9,42.89 VR2.1 | 68.45,38.1 68.45,39.62 67.06,41.02 60.71,41.02 59.69,40.01 57.28,40.01 56.52,40.77 51.31,40.77 50.93,41.15 C14.2 50.59,41.91 48.9,41.91 | U3.24 59.69,13.59 | 59.69,13.59 60.07,13.97 68.2,13.97 69.47,15.24 69.47,23.11 68.2,24.38 65.41,24.38 65.28,24.51 65.28,35.56 64.94,35.9 | 6.22,24.13 4.19,24.13 3.57,24.75 R58.2 | 6.22,24.13 8.64,24.13 | 8.64,24.13 11.18,24.13 | 11.18,24.13 13.72,24.13 | 13.72,24.13 16.26,24.13 | 16.26,24.13 18.8,24.13 | 18.8,24.13 21.34,24.13 | 21.34,24.13 22.48,24.13 | 22.48,24.13 24.89,24.13 | 24.89,24.13 27.69,24.13 | 27.69,24.13 30.23,24.13 | 30.23,24.13 32.77,24.13 | 32.77,24.13 35.43,24.13 | 35.43,24.13 37.85,24.13 | 37.85,24.13 40.39,24.13 | 40.39,24.13 42.8,24.13 | 42.8,24.13 44.32,24.13 | 33.4,39.88 34.42,39.88 34.8,40.26 U5.16 | C18.1 33.4,39.88 | 33.4,39.88 27.69,39.88 | C5.1 64.94,39.98 U2.52 64.94,37.34 | 27.69,39.88 24.13,43.43 22.99,43.43 21.97,44.45 16.13,44.45 14.73,43.05 U4.16 14.73,41.02 14.35,40.64 13.45,40.64 C17.1 11.41,40.75 11.16,40.5 5.09,40.5 3.94,41.66 3.94,43.05 | C2.1 55.29,38.73 U2.64 54.99,38.44 54.99,36.07 | ICSP.2 49.66,28.19 49.15,28.7 44.45,28.7 44.32,28.57 | 59.69,13.59 59.04,13.59 C16.1 | U1.7 3.94,43.05 | 1.65,43.05 U1.8 3.94,43.05 | R4.2 R9.2 2.16,43.56 1.65,43.05
  Top 0.406: C12.2 0.76,42.16 1.65,43.05 | 44.32,24.13 44.32,21.7 R7.2 | 44.32,24.13 44.32,28.57 | 44.32,28.57 44.32,32.64 | 44.32,32.64 44.32,34.92 44.58,35.18 44.96,35.18 46.86,37.08 48.26,37.08 | 54.99,36.07 64.77,36.07 64.94,35.9 | 64.94,37.34 64.94,35.9 | 68.45,38.1 67.69,37.34 64.94,37.34 | 22.48,24.13 22.73,24.38 22.73,33.27 27.81,38.35 27.81,39.75 27.69,39.88 | 27.69,24.13 27.7,24.14 R65.2 | R11.2 44.34,32.62 44.32,32.64 | C4.1 48.24,37.07 48.26,37.08 | R66.2 25.16,24.4 24.89,24.13 | R64.2 30.24,24.14 30.23,24.13 | R63.2 32.78,24.14 32.77,24.13 | R62.2 35.32,24.24 35.43,24.13 | R61.2 37.86,24.14 37.85,24.13 | R60.2 40.4,24.14 40.39,24.13 | R59.2 42.94,24.27 42.8,24.13 | R57.2 6.11,24.24 6.22,24.13 | R56.2 8.65,24.14 8.64,24.13 | R55.2 11.19,24.14 11.18,24.13 | R54.2 13.73,24.14 13.72,24.13 | R53.2 16.27,24.14 16.26,24.13 | R52.2 18.81,24.14 18.8,24.13 | R51.2 21.35,24.14 21.34,24.13 | 68.45,38.1 70.36,38.1 71.12,37.34 72.72,37.34
+5V_EXT  (via drill 0.4 pad 0.7)  (1 unrouted)
  Top 0.406: TSCREEN.1 76.75,51.73 C13.1 75.56,50.29 74.04,48.77 VR1.2 | R13.1 78.47,38.23 D4.A 75.95,38.23 74.04,40.13 VR1.4
  other vias: 71.37,44.07 76.71,44.07 71.37,41.15 71.37,40.26 76.71,41.15 74.04,44.07 76.71,40.26 71.37,42.04 76.71,42.04 72.64,44.07 75.44,44.07
  pour Bottom (isolate 0.254, no thermals): 70.36,45.34 77.72,45.34 77.72,39.62 70.36,39.62
  pour Top (isolate 0.254, no thermals): 70.36,45.34 77.72,45.34 77.72,39.62 70.36,39.62
A_IN_1
  Top 0.203: CONN12.1 25.4,10.67 25.78,10.29 25.78,6.22 27.3,4.7 44.32,4.7 47.62,8 53.59,8 54.48,7.11 67.31,7.11 69.85,9.65 U3.16
A_IN_2
  Top 0.203: CONN12.2 27.94,10.67 28.32,10.29 28.32,6.1 29.34,5.08 44.07,5.08 47.37,8.38 53.85,8.38 54.74,7.49 66.42,7.49 68.58,9.65 U3.17
A_IN_3
  Top 0.203: CONN12.3 30.61,10.67 30.86,10.41 30.86,6.1 31.5,5.46 43.81,5.46 47.12,8.76 54.1,8.76 54.99,7.87 65.53,7.87 67.31,9.65 U3.18
A_IN_4
  Top 0.203: CONN12.4 33.15,10.67 33.4,10.41 33.4,6.86 34.42,5.84 43.56,5.84 46.86,9.14 54.36,9.14 55.24,8.26 64.64,8.26 66.04,9.65 U3.19
A_IN_5
  Top 0.203: CONN12.5 35.56,10.67 35.94,10.29 35.94,6.6 36.32,6.22 43.31,6.22 46.61,9.53 54.61,9.53 55.5,8.64 63.75,8.64 64.77,9.65 U3.20
A_IN_6
  Top 0.203: CONN12.6 38.1,10.67 38.48,10.29 38.48,6.99 38.86,6.6 43.05,6.6 46.35,9.91 54.86,9.91 55.75,9.02 62.74,9.02 63.5,9.78 U3.21
A_IN_7
  Top 0.203: CONN12.7 40.26,10.67 41.53,9.4 44.58,9.4 45.47,10.29 55.12,10.29 56.01,9.4 61.47,9.4 62.23,10.16 U3.22
A_IN_8
  Top 0.203: U3.23 60.96,10.54 60.2,9.78 56.26,9.78 55.37,10.67 CONN12.8
A_IN_9  (via drill 0.4 pad 0.7)
  Top 0.203: U3.2 60.96,3.43 60.33,4.06 52.45,4.06 51.56,4.95 49.66,4.95 46.35,1.65 11.81,1.65 10.54,2.92 10.54,3.3 v8.64,5.21
  Bottom 0.203: CONN11.1 3.81,10.67 4.19,10.29 4.19,9.53 4.32,9.4 6.48,9.4 6.73,9.14 6.73,7.11 v8.64,5.21
A_IN_10
  Top 0.203: CONN11.2 6.48,10.67 6.73,10.41 6.73,6.86 6.86,6.73 8.64,6.73 11.05,4.32 11.05,3.05 12.06,2.03 46.1,2.03 49.4,5.33 51.82,5.33 52.7,4.45 61.59,4.45 62.23,3.81 U3.3
A_IN_11
  Top 0.203: CONN11.3 8.89,10.67 9.27,10.29 9.27,6.73 11.56,4.45 11.56,3.17 12.32,2.41 45.85,2.41 49.15,5.71 52.07,5.71 52.96,4.83 62.74,4.83 63.5,4.06 U3.4
A_IN_12
  Top 0.203: CONN11.4 11.56,10.67 11.81,10.41 11.81,4.95 13.97,2.79 45.59,2.79 48.9,6.1 52.32,6.1 53.21,5.21 64.01,5.21 64.77,4.45 U3.5
A_IN_13
  Top 0.203: CONN11.5 14.1,10.67 14.35,10.41 14.35,5.33 16.51,3.17 45.34,3.17 48.64,6.48 52.58,6.48 53.47,5.59 65.53,5.59 66.04,5.08 U3.6
A_IN_14
  Top 0.203: CONN11.6 16.64,10.67 16.89,10.41 16.89,5.84 19.18,3.56 45.09,3.56 48.39,6.86 52.83,6.86 53.72,5.97 66.8,5.97 67.31,5.46 U3.7
A_IN_15
  Top 0.203: CONN11.7 19.18,10.67 19.43,10.41 19.43,5.97 21.46,3.94 44.83,3.94 48.13,7.24 53.09,7.24 53.98,6.35 67.94,6.35 68.58,5.71 U3.8
A_IN_16
  Top 0.203: CONN11.8 21.46,10.67 21.97,10.16 21.97,6.99 24.64,4.32 44.58,4.32 47.88,7.62 53.34,7.62 54.23,6.73 68.83,6.73 69.85,5.71 U3.9
BTLDR_SW  (via drill 0.4 pad 0.7)
  Top 0.203: R12.1 7.24,52.96 27.81,52.96 28.83,51.94 v28.83,50.93 | R11.1 45.7,33.92 46.1,33.53 46.1,32.38 v46.61,31.88 46.35,31.88 46.1,31.62 46.1,30.48 46.37,30.21 51.94,30.21 52.32,30.59 U2.9
  Bottom 0.203: v46.61,31.88 46.1,32.38 46.1,33.53 45.72,33.91 45.72,36.07 45.97,36.32 45.97,37.21 45.59,37.59 44.83,37.59 44.2,38.23 44.2,44.7 43.69,45.21 41.27,45.21 35.69,50.8 28.96,50.8 v28.83,50.93
D+
  Top 0.203: R2.1 U2.5
D+X  (via drill 0.4 pad 0.7)
  Top 0.203: R2.2 47.62,33.78 v47.24,34.16 | USB.A6 70.53,51.71 D2.2 | v48.77,44.96 50.8,46.99 53.85,46.99 56.26,49.4 61.72,49.4 62.23,49.91 62.23,54.36 63.5,55.63 69.09,55.63 69.68,55.03 USB.B6
  Bottom 0.203: USB.B6 69.68,54.02 69.85,53.85 70.1,53.85 70.53,53.42 USB.A6 | v47.24,34.16 47.24,37.85 48.77,39.37 v48.77,44.96
D-
  Top 0.203: U2.4 49.88,34.59 R1.1
D-X  (via drill 0.4 pad 0.7)
  Top 0.203: R1.2 46.74,34.92 v46.48,35.18 | v47.75,44.96 50.16,47.37 53.59,47.37 56.01,49.78 61.34,49.78 61.72,50.16 61.72,54.48 63.25,56.01 69.85,56.01 70.53,55.33 USB.B7 70.53,54.02 70.36,53.85 69.85,53.85 69.68,53.68 USB.A7 69.68,52.53 68.96,51.82 68.44,51.82 D2.3
  Bottom 0.203: v46.48,35.18 46.48,37.72 47.75,38.99 v47.75,44.96
D_IN_1
  Top 0.203: CONN10.1 23.86,28.56 R34.2 R66.1
D_IN_2
  Top 0.203: CONN10.3 26.4,28.56 R33.2 R65.1
D_IN_3
  Top 0.203: CONN10.5 28.94,28.56 R32.2 R64.1
D_IN_4
  Top 0.203: CONN10.7 31.48,28.56 R31.2 R63.1
D_IN_5
  Top 0.203: R62.1 R30.2 34.02,28.56 CONN10.9
D_IN_6
  Top 0.203: R61.1 R29.2 36.56,28.56 CONN10.11
D_IN_7
  Top 0.203: CONN10.13 39.1,28.56 R28.2 R60.1
D_IN_8
  Top 0.203: CONN10.15 41.64,28.56 R27.2 R59.1
D_IN_9
  Top 0.203: CONN15.1 2.27,28.56 R26.2 R58.1
D_IN_10
  Top 0.203: CONN15.3 4.81,28.56 R25.2 R57.1
D_IN_11
  Top 0.203: CONN15.5 7.35,28.56 R24.2 R56.1
D_IN_12
  Top 0.203: CONN15.7 9.89,28.56 R23.2 R55.1
D_IN_13
  Top 0.203: CONN15.9 12.43,28.56 R22.2 R54.1
D_IN_14
  Top 0.203: CONN15.11 14.97,28.56 R21.2 R53.1
D_IN_15
  Top 0.203: CONN15.13 17.51,28.56 R20.2 R52.1
D_IN_16
  Top 0.203: CONN15.15 20.05,28.56 R19.2 R51.1
D_OUT_1_L
  Top 0.203: R50.2 23.86,19.29 CONN9.1
D_OUT_1_R
  Top 0.203: U2.26 62.54,22.55 63.12,21.97 64.39,21.97 65.91,20.45 65.91,17.27 63.63,14.99 28.21,14.99 R50.1
D_OUT_2_L
  Top 0.203: R49.2 26.4,19.29 CONN9.3
D_OUT_2_R
  Top 0.203: R49.1 27.7,17.64 29.97,15.37 63.25,15.37 65.41,17.53 65.41,20.32 64.14,21.59 62.74,21.59 62.48,21.84 61.98,21.84 61.74,22.08 U2.25
D_OUT_3_L
  Top 0.203: R48.2 28.94,19.29 CONN9.5
D_OUT_3_R
  Top 0.203: R48.1 30.24,17.38 31.88,15.75 49.66,15.75 55.37,21.46 56.26,21.46 56.94,22.14 U2.19
D_OUT_4_L
  Top 0.203: R47.2 31.48,19.29 CONN9.7
D_OUT_4_R
  Top 0.203: R47.1 32.78,17.51 34.16,16.13 49.4,16.13 55.24,21.97 55.88,21.97 56.13,22.23 U2.18
D_OUT_5_L
  Top 0.203: R46.2 34.02,19.29 CONN9.9
D_OUT_5_R
  Top 0.203: R46.1 35.32,17.51 36.32,16.51 49.15,16.51 54.23,21.59 54.23,22.61 54.81,23.19 U2.17
D_OUT_6_L
  Top 0.203: R45.2 36.56,19.29 CONN9.11
D_OUT_6_R
  Top 0.203: R45.1 37.86,17.26 38.23,16.89 48.9,16.89 52.83,20.83 52.83,24.28 U2.16
D_OUT_7_L
  Top 0.203: R44.2 39.1,19.29 CONN9.13
D_OUT_7_R
  Top 0.203: R44.1 40.4,17.51 40.64,17.27 48.64,17.27 52.45,21.08 52.45,25.4 52.84,25.79 U2.15
D_OUT_8_L
  Top 0.203: R43.2 41.77,19.42 CONN9.15
D_OUT_8_R
  Top 0.203: U2.14 52.37,26.59 52.07,26.29 52.07,21.34 48.77,18.03 R43.1
D_OUT_9_L
  Top 0.203: R42.1 2.27,19.29 CONN16.1
D_OUT_9_R  (via drill 0.4 pad 0.7)
  Top 0.203: R42.2 3.57,17 v3.94,16.64 | U2.33 67.09,24.99 v66.67,25.4
  Bottom 0.203: v66.67,25.4 61.09,25.4 51.44,15.75 27.69,15.75 26.42,14.48 6.1,14.48 v3.94,16.64
D_OUT_10_L
  Top 0.203: R41.1 4.81,19.29 CONN16.3
D_OUT_10_R  (via drill 0.4 pad 0.7)
  Top 0.203: R41.2 6.11,17.26 v6.6,16.76 | U2.34 67.43,25.79 v66.67,26.54
  Bottom 0.203: v66.67,26.54 61.59,26.54 51.18,16.13 27.43,16.13 26.16,14.86 8.51,14.86 v6.6,16.76
D_OUT_11_L
  Top 0.203: R40.1 7.35,19.29 CONN16.5
D_OUT_11_R  (via drill 0.4 pad 0.7)
  Top 0.203: 8.65,18.02 R40.2 8.76,17.92 v8.76,16.76 | U2.35 67.77,26.59 v66.67,27.69
  Bottom 0.203: v8.76,16.76 9.91,15.62 26.29,15.62 27.18,16.51 50.93,16.51 62.1,27.69 v66.67,27.69
D_OUT_12_L
  Top 0.203: R39.1 9.89,19.29 CONN16.7
D_OUT_12_R  (via drill 0.4 pad 0.7)
  Top 0.203: R39.2 11.19,17.77 13.59,15.37 24.26,15.37 v25.27,16.38 | U2.36 68.12,27.39 v66.67,28.83
  Bottom 0.203: v25.27,16.38 25.78,16.89 50.67,16.89 62.61,28.83 v66.67,28.83
D_OUT_13_L
  Top 0.203: R38.1 12.43,19.29 CONN16.9
D_OUT_13_R  (via drill 0.4 pad 0.7)
  Top 0.203: R38.2 13.73,17.89 15.49,16.13 23.62,16.13 v23.88,16.38 | U2.37 68.46,28.19 v66.67,29.97
  Bottom 0.203: v23.88,16.38 24.77,17.27 50.42,17.27 63.12,29.97 v66.67,29.97
D_OUT_14_L
  Top 0.203: R37.1 14.97,19.29 CONN16.11
D_OUT_14_R  (via drill 0.4 pad 0.7)
  Top 0.203: R37.2 16.27,17.77 17.4,16.64 22.35,16.64 v22.73,17.02 | U2.38 68.42,28.99 67.44,29.97 67.44,30.35 v66.67,31.11
  Bottom 0.203: v22.73,17.02 23.37,17.65 50.16,17.65 63.63,31.11 v66.67,31.11
D_OUT_15_L
  Top 0.203: R36.1 17.51,19.29 CONN16.13
D_OUT_15_R  (via drill 0.4 pad 0.7)
  Top 0.203: R36.2 18.81,17.51 19.18,17.14 21.72,17.14 v22.73,18.16 | U2.39 68.26,29.79 67.82,30.23 67.82,30.61 67.44,30.99 67.44,31.5 v66.67,32.26
  Bottom 0.203: v22.73,18.16 23.24,18.16 23.37,18.03 49.91,18.03 64.14,32.26 v66.67,32.26
D_OUT_16_L
  Top 0.203: R35.1 20.05,19.29 CONN16.15
D_OUT_16_R  (via drill 0.4 pad 0.7)
  Top 0.203: v22.61,19.3 22.1,19.3 21.34,18.54 21.34,18.05 R35.2 | U2.40 68.47,30.59 68.2,30.86 68.2,32.64 67.44,33.4 v66.67,33.4
  Bottom 0.203: v22.61,19.3 22.73,19.3 23.62,18.41 49.66,18.41 64.64,33.4 v66.67,33.4
D_OUT_17  (via drill 0.4 pad 0.7)
  Top 0.203: U2.31 66.54,21.98 66.67,21.84 v67.31,21.84 | v73.79,19.05 R76.1
  Bottom 0.203: v67.31,21.84 70.99,21.84 v73.79,19.05
D_OUT_17_HV  (via drill 0.4 pad 0.7)
  Top 0.406: Q5.4 74.49,24.57 v74.8,24.26 | D14.3 74.87,2.85 v74.8,2.92
  Bottom 0.406: v74.8,24.26 77.47,24.26 77.85,23.88 77.85,14.62 CONN5.2 78.37,12.21 74.68,8.51 74.68,3.05 v74.8,2.92
D_OUT_18  (via drill 0.4 pad 0.7)
  Top 0.203: U2.32 67.87,23.19 v68.33,22.73 | v73.79,21.72 R75.1
  Bottom 0.203: v68.33,22.73 72.77,22.73 v73.79,21.72
D_OUT_18_HV  (via drill 0.4 pad 0.7)
  Top 0.406: Q5.6 76.39,26.36 v76.33,26.42 | v74.55,1.52 74.55,1.17 74.76,0.95 D14.4
  Bottom 0.406: v76.33,26.42 77.34,26.42 78.74,25.02 78.74,20.73 CONN5.4 81.92,17.55 81.92,10.79 81.53,10.41 79.38,10.41 77.47,8.51 77.47,1.91 74.93,1.91 v74.55,1.52
D_OUT_19  (via drill 0.4 pad 0.7)
  Top 0.203: U2.29 64.94,22.05 66.55,20.45 66.55,19.68 66.67,19.56 v67.31,19.56 | v73.79,13.97 R78.1
  Bottom 0.203: v67.31,19.56 69.22,19.56 70.23,18.54 70.23,16.76 73.03,13.97 v73.79,13.97
D_OUT_19_HV  (via drill 0.4 pad 0.7)
  Top 0.406: Q2.4 74.49,29.78 74.3,29.97 73.53,29.97 73.41,30.1 73.41,32.13 74.48,33.2 CONN5.8 | v82.3,20.95 82.3,18.29 81.41,17.4 79.12,17.4 77.85,16.13 77.85,12.83 75.18,10.16 75.18,6.94 76.09,6.03 D12.3
  Bottom 0.406: v82.3,20.95 82.3,31.17 CONN5.8
D_OUT_20  (via drill 0.4 pad 0.7)
  Top 0.203: U2.30 65.74,21.89 66.93,20.7 v67.31,20.7 | v73.79,16.51 R77.1
  Bottom 0.203: v67.31,20.7 69.6,20.7 v73.79,16.51
D_OUT_20_HV  (via drill 0.4 pad 0.7)
  Top 0.406: Q2.6 76.39,30.16 76.2,30.35 v76.33,30.35 | v84.2,14.35 84.07,14.22 83.19,14.22 82.8,13.84 79.12,13.84 78.61,13.34 78.61,11.43 77.47,10.29 77.47,4.57 77.03,4.13 D12.4 | v83.82,24.89 83.57,25.15 81.32,25.15 CONN5.6
  Bottom 0.406: CONN5.6 78.49,27.98 78.49,29.59 77.72,30.35 v76.33,30.35 | v84.2,14.35 84.2,24.51 v83.82,24.89
GND  (via drill 0.4 pad 0.7, 3.2 pad 5.3)
  Top 0.406: U2.22 59.34,21.89 C6.2 | Q5.2 Q5.5 | Q2.2 Q2.5
  other vias: 83.5,58.45 3.5,58.45 3.5,3.45 83.5,3.45 57.78,17.14 62.48,16.64 56.46,10.77 67.56,16.36 50.67,3.78 73.28,5.84 62.1,40.13 51.05,39.12 49.66,43.31 31.11,42.16 12.06,42.04 48.39,56.01 70.99,8.76 73.15,9.78 51.94,32.97 24.77,36.96 16.64,43.43 43.31,34.62 61.85,24.51 57.28,29.34 62.1,32.77 61.98,37.21 73.79,20.32 73.79,22.99 73.79,17.78 73.79,15.24 75.18,30.35 74.68,26.42 46.86,32.97 50.67,35.38 47.55,13.08 52.55,14.2 28.45,36.32 15.49,49.02 27.69,45.85 32.13,45.85 38.73,45.72 56.01,37.47 53.85,59.69 72.39,32.51 79.38,51.69 82.68,51.44 82.68,49.53 82.68,47.62 82.68,43.81 82.68,45.72 60.96,57.15 73.79,51.69 54.86,55.37 57.15,45.59 80.14,1.91 46.99,30.94 68.96,42.93 70.23,47.88 63.5,44.96
  pour Top (isolate 0.254, rank 2): 0,62 0,0 87,0 87,62
  pour Bottom (isolate 0.305, rank 2): 0,62 0,0 87,0 87,62
LED_IND_DIN_IN
  Top 0.203: U2.46 70.53,35.39 71.63,34.29 78.49,34.29 79.25,35.05 82.8,35.05 83.31,35.56 R16.1
LED_IND_DIN_OUT
  Top 0.203: R15.1 84.45,35.69 83.31,34.54 79.38,34.54 78.74,33.91 70.74,33.91 70.06,34.59 U2.45
LED_IND_USB_IN
  Top 0.203: U2.48 70.2,36.99 72.14,35.05 77.85,35.05 78.74,35.94 80.52,35.94 81.03,36.45 R18.1
LED_IND_USB_OUT
  Top 0.203: U2.47 70.36,36.19 71.88,34.67 78.11,34.67 78.87,35.43 81.66,35.43 82.17,35.94 R17.1
MISO
  Top 0.203: U2.13 52.28,27.39 51.69,26.8 51.69,24.13 51.05,23.5 46.48,23.5 45.85,24.13 45.85,26.92 46.23,27.3 ICSP.1
MOSI
  Top 0.203: U2.12 52.32,28.19 51.31,27.18 51.31,25.4 50.67,24.77 ICSP.4
MUX_COMMON
  Top 0.203: U3.1 58.46,2.14 R10.2
MUX_S0
  Top 0.203: U2.41 70.21,31.39 70.48,31.11 70.48,9.65 69.09,8.26 69.09,7.11 71.12,5.08 U3.10
MUX_S1
  Top 0.203: U3.11 72.39,8.76 71.75,9.4 71.75,13.46 70.87,14.35 70.87,31.5 70.17,32.19 U2.42
MUX_S2
  Top 0.203: U2.43 70.39,32.99 71.25,32.13 71.25,14.61 72.39,13.46 U3.14
MUX_S3
  Top 0.203: U3.13 73.66,12.83 71.63,14.86 71.63,32.38 70.23,33.78 U2.44
N$1
  Top 0.203: CONN3.4 35.75,52 32.77,54.99 1.78,54.99 0.76,53.98 R5.1
N$2
  Top 0.406: USB.A9 67.98,52.74 67.31,52.07 66.55,52.07 65.45,50.97 F1.2
  Bottom 0.406: USB.A9 USB.B4 67.98,55.28 68.45,55.75 71.75,55.75 72.23,55.28 USB.B9 USB.A4
N$3  (via drill 0.4 pad 0.7)
  Top 0.203: v0.76,48.01 R5.2 | D1.C 9.36,39.58 U1.2
  Bottom 0.203: U1.2 5.21,39.5 3.94,40.77 3.94,44.96 1.65,47.24 1.52,47.24 v0.76,48.01
N$4
  Top 0.203: D1.A 9.7,37.38 U1.3
  Bottom 0.203: U1.3 7.75,40.51 9.02,41.78 9.02,48.9 11.94,51.82 42.29,51.82 45.75,48.35 CONN3.5
N$5
  Top 0.203: R4.1 1.02,46.86 2.54,48.39 8.89,48.39 10.85,46.42 CONN2.4
N$6
  Top 0.203: R3.1 1.91,50.8 2.16,51.05 21.21,51.05 24.04,48.23 CONN2.5
N$7
  Top 0.203: R6.1 2.43,49.66 R3.2
N$8
  Top 0.203: R34.1 25.27,27.3 25.78,27.81 25.78,33.53 26.8,34.54 30.86,34.54 32.38,36.07 32.38,38.61 32.89,39.12 35.18,39.12 35.94,39.88 36.7,39.88 37.34,40.51 U5.14
N$9
  Top 0.203: R33.1 27.7,27.95 28.32,28.57 28.32,33.27 28.83,33.78 31.11,33.78 32.89,35.56 32.89,38.35 33.15,38.61 35.43,38.61 36.2,39.37 37.72,39.37 38.61,40.26 U5.13
N$10
  Top 0.203: R32.1 30.24,27.95 30.86,28.57 30.86,32.51 32.13,33.78 34.04,33.78 35.43,35.18 35.43,37.85 36.45,38.86 38.73,38.86 39.88,40.01 U5.12
N$11
  Top 0.203: R18.2 81.03,39.75 80.9,39.88 80.26,39.88 79.5,40.64 79.5,45.72 80.14,46.35 80.14,47.37 80.39,47.62 D11.A
N$12
  Top 0.203: R17.2 82.17,40.01 81.92,40.26 80.52,40.26 79.88,40.89 79.88,45.47 80.14,45.72 D10.A
N$13
  Top 0.203: R16.2 83.31,40.01 82.68,40.64 80.77,40.64 80.39,41.02 80.39,43.43 80.77,43.81 D9.A
N$14
  Top 0.203: D8.A 82.55,41.91 82.68,41.78 82.68,41.15 82.8,41.02 83.57,41.02 84.45,40.13 R15.2
N$15
  Top 0.203: R31.1 32.78,27.95 33.4,28.57 33.4,33.02 33.78,33.4 36.2,33.4 36.7,33.91 36.7,37.85 37.21,38.35 39.75,38.35 41.15,39.75 U5.11
N$16
  Top 0.203: R30.1 35.32,27.95 35.94,28.57 35.94,32.51 37.34,33.91 U5.3
N$17
  Top 0.203: R29.1 37.86,27.95 38.48,28.57 38.48,34.8 38.61,34.92 U5.4
N$18
  Top 0.203: R28.1 40.4,27.95 41.02,28.57 41.02,33.53 39.88,34.67 U5.5
N$19
  Top 0.203: R27.1 43.31,27.3 43.56,27.56 43.56,33.27 43.31,33.53 42.29,33.53 41.15,34.67 U5.6
N$20  (via drill 0.4 pad 0.7)
  Top 0.203: v57.78,3.3 57.13,2.65 R10.1 56.06,1.08 D5.1 | v57.78,37.21 57.78,38.74 U2.61
  Bottom 0.203: v57.78,37.21 57.78,33.78 58.42,33.15 59.05,33.15 60.07,34.16 68.45,34.16 69.22,33.4 69.22,25.02 68.71,24.51 64.77,24.51 64.26,24 64.26,21.46 65.28,20.45 65.28,6.1 62.48,3.3 v57.78,3.3
N$21
  Top 0.203: R13.2 78.74,46.23 79.25,46.74 79.25,49.66 80.01,50.42 80.01,51.05 80.39,51.44 D6.A
N$22
  Top 0.203: R14.2 79.88,39.62 79.63,39.88 79.38,39.88 79.12,40.13 79.12,45.97 79.63,46.48 79.63,49.15 80.01,49.53 D7.A
N$23
  Top 0.203: R9.1 2.56,45.73 R8.2
  Bottom 0.203: U1.6 7.75,43.31 R8.2
N$24
  Top 0.203: Q5.1 76.56,27.58 77.34,26.8 77.34,23.11 77.22,22.99 R70.1
  Top 0.305: R75.2 R70.1
N$25
  Top 0.203: R69.1 77.47,20.32 77.85,20.7 77.85,27.56 76.96,28.45 74.8,28.45 74.49,28.13 Q5.3
  Top 0.305: R76.2 R69.1
N$26
  Top 0.203: R68.1 77.47,17.78 78.23,18.54 78.23,30.73 77.45,31.52 Q2.1
  Top 0.305: R77.2 R68.1
N$27  (via drill 0.4 pad 0.7)
  Top 0.406: 82.11,53.4 Q1.2 v83.44,53.21
  Bottom 0.406: v83.44,53.21 81.15,53.21 81.15,52.07 79.38,50.29 60.41,50.29 EXT.PWR1
N$28
  Top 0.203: R71.2 71.36,53.23 USB.A5
N$29
  Top 0.203: R67.1 76.58,15.24 77.34,16 77.34,17.02 78.61,18.29 78.61,30.99 77.34,32.26 74.8,32.26 74.49,31.94 Q2.3
  Top 0.305: R78.2 R67.1
N$30
  Top 0.406: USB.P3 64.73,57.61 L1.2
  Bottom 0.406: USB.P1 USB.P4 USB.P3 USB.P2
N$31
  Top 0.203: USB.B5 68.83,54.1 68.58,53.85 66.8,53.85 66.67,53.72 arc-4 66.42,53.09 arc-111 64.37,52.7 R72.2
N$40
  Top 0.203: R26.1 3.57,27.45 4.19,28.07 4.19,32.77 4.7,33.27 5.97,33.27 6.73,34.04 8.64,34.04 9.02,34.42 9.02,35.94 9.53,36.45 13.08,36.45 13.34,36.7 13.34,38.86 14.61,40.13 17.14,40.13 17.27,40.26 U4.14
N$41
  Top 0.203: R25.1 6.11,27.7 6.73,28.32 6.73,32.77 7.49,33.53 9.02,33.53 9.27,33.78 11.05,33.78 12.32,35.05 13.34,35.05 13.84,35.56 13.84,38.61 14.86,39.62 17.65,39.62 18.54,40.51 U4.13
N$42
  Top 0.203: R24.1 8.65,27.7 9.27,28.32 9.27,32.51 10.03,33.27 11.3,33.27 12.57,34.54 14.61,34.54 15.37,35.31 15.37,37.85 16.13,38.61 19.43,38.61 19.81,38.99 U4.12
N$43
  Top 0.203: R23.1 11.19,27.95 11.81,28.57 11.81,33.02 12.32,33.53 16.26,33.53 16.64,33.91 16.64,37.85 16.89,38.1 20.7,38.1 21.08,38.48 U4.11
N$44
  Top 0.203: R22.1 13.73,27.7 14.35,28.32 14.35,32.77 14.73,33.15 16.89,33.15 17.27,33.53 U4.3
N$45
  Top 0.203: R21.1 16.27,27.95 16.89,28.57 16.89,32.51 17.53,33.15 18.41,33.15 18.54,33.27 U4.4
N$46
  Top 0.203: R20.1 18.81,27.7 19.43,28.32 19.43,32.51 19.81,32.89 U4.5
N$47
  Top 0.203: R19.1 21.72,27.3 21.97,27.56 21.97,32.51 21.08,33.4 U4.6
RESET  (via drill 0.4 pad 0.7)
  Top 0.203: U2.20 57.74,24.05 57.15,24.64 55.24,24.64 54.61,24 53.98,24 v53.72,23.75 | R7.1 47.13,22.21 ICSP.5
  Bottom 0.203: v53.72,23.75 51.31,23.75 51.05,23.5 48.39,23.5 ICSP.5
SCK
  Top 0.203: ICSP.3 48.39,26.04 50.67,26.04 50.93,26.29 50.93,28.19 51.72,28.99 U2.11
SR_IN_CLOCK  (via drill 0.4 pad 0.7)
  Top 0.203: U5.2 36.07,34.42 35.94,34.29 v35.81,34.29 | U4.2 16,34.67 v15.62,34.29 | v45.34,31.37 45.34,30.48 46.03,29.79 U2.10
  Bottom 0.203: v15.62,34.29 v35.81,34.29 41.91,34.29 44.83,31.37 v45.34,31.37
SR_IN_DAISY_OUT_1  (via drill 0.4 pad 0.7)
  Top 0.203: U4.9 23.62,39.75 v24,39.37 | U5.10 42.42,39.75 v42.29,39.62
  Bottom 0.203: v24,39.37 42.04,39.37 v42.29,39.62
SR_IN_DATA
  Top 0.203: U5.9 43.69,39.62 45.21,38.1 51.18,38.1 52.29,36.99 U2.1
SR_IN_LATCH  (via drill 0.4 pad 0.7)
  Top 0.203: U4.1 14.73,38.48 15.37,39.12 18.41,39.12 v18.67,39.37 | U2.2 52.46,36.19 51.05,37.59 45.97,37.59 v45.21,36.83 | U5.1 33.72,36.52 v33.66,36.58
  Bottom 0.203: v18.67,39.37 22.48,39.37 23.5,38.35 29.34,38.35 31.11,36.58 v33.66,36.58 44.96,36.58 v45.21,36.83
UART_RX  (via drill 0.4 pad 0.7)
  Top 0.203: U2.27 63.34,27.84 v56.9,34.29 | v45.21,55.24 v45.21,53.59
  Bottom 0.203: v56.9,34.29 56.9,40.89 54.61,43.18 52.07,43.18 49.91,45.34 49.91,51.31 47.62,53.59 v45.21,53.59 12.95,53.59 R8.1 | TSCREEN.4 77.22,60.58 50.55,60.58 v45.21,55.24
UART_TX  (via drill 0.4 pad 0.7)
  Top 0.203: U2.28 64.14,28.7 v58.55,34.29
  Bottom 0.203: v58.55,34.29 58.55,39.88 54.86,43.56 52.32,43.56 50.29,45.59 50.29,52.07 | 50.29,52.07 50.29,54.99 54.74,59.44 75.18,59.44 76.96,57.66 TSCREEN.3 | R6.2 11.18,54.36 48.01,54.36 50.29,52.07
UCAP
  Top 0.203: U2.7 49.94,32.19 C11.2
VIN
  Top 0.406: 85.72,29.84 85.72,22.73 | 85.72,22.73 85.72,15.62 | 85.72,15.62 85.72,10.41 84.02,8.71 CONN5.1 78.57,7.01 D12.2 D12.1 D14.2 D14.1 | CONN5.3 85.64,15.71 85.72,15.62 | CONN5.5 85.7,22.7 85.72,22.73 | CONN5.7 85.58,29.7 85.72,29.84 | 85.72,29.84 85.72,52.83 84.2,54.36 81.15,54.36 | 81.15,54.36 79.25,54.36 78.74,53.85 76.33,53.85 75.95,53.47 75.95,52.45 73.79,50.29 72.52,50.29 71.73,49.51 VR1.3 70.17,46.24 C10.1 | 81.15,54.36 81.15,55.4 Q1.3
VUSB
  Top 0.406: R14.1 79.88,36.96 79.76,36.83 76.63,36.83 D3.A 74.68,36.32 74.42,36.58 74.42,38.48 73.66,39.24 69.85,39.24 67.44,41.66 | D2.4 67.73,44.49 67.44,44.2 67.44,41.66 | 55.63,41.66 55.49,41.66 C7.1 | C9.1 55.63,41.66 | 55.63,41.66 61.47,41.66 | 61.47,41.66 67.44,41.66 | F1.1 61.55,41.74 61.47,41.66
XTAL1
  Top 0.203: U2.24 60.94,21.86 61.34,21.46 62.23,21.46 62.48,21.21 62.48,20.59 Y1.1 63.88,20.2 C1.2
XTAL2
  Top 0.203: U2.23 60.14,21.65 60.71,21.08 61.59,21.08 61.72,20.95 61.72,19.55 Y1.3 59.16,18.4 C8.2

### Text on the board
tNames: RX | TX | GND | DFU | +5V | DOUT | EXT | USB | U< | DIN | U> | MIDI OUT | MIDI IN | D< | D> | 16 | 15 | 14 | 13 | 12 | 11 | 10 | 9 | 8 | 7 | 6 | 5 | 4 | 3 | 2 | 1 | BUTTONS | HV4 | VIN | HV3 | C | LEDs | VIN | A | HV2 | 16 | 15 | 14 | 13 | 12 | 11 | 10 | 9 | 8 | 7 | 6 | 5 | 4 | 3 | 2 | 1 | +3V3 | VIN | ANALOG | S | HV1 | GND | VIN | OpenDeck Mini
bNames: OpenDeck Mini board / Revision: 1.0.0 / 06/2021 | https://radiona.org | https://shanteacontrols.com